# EAGLE schematic PKG900000001506 (EAGLE 7.7.0)

## Sheet 1 of 18
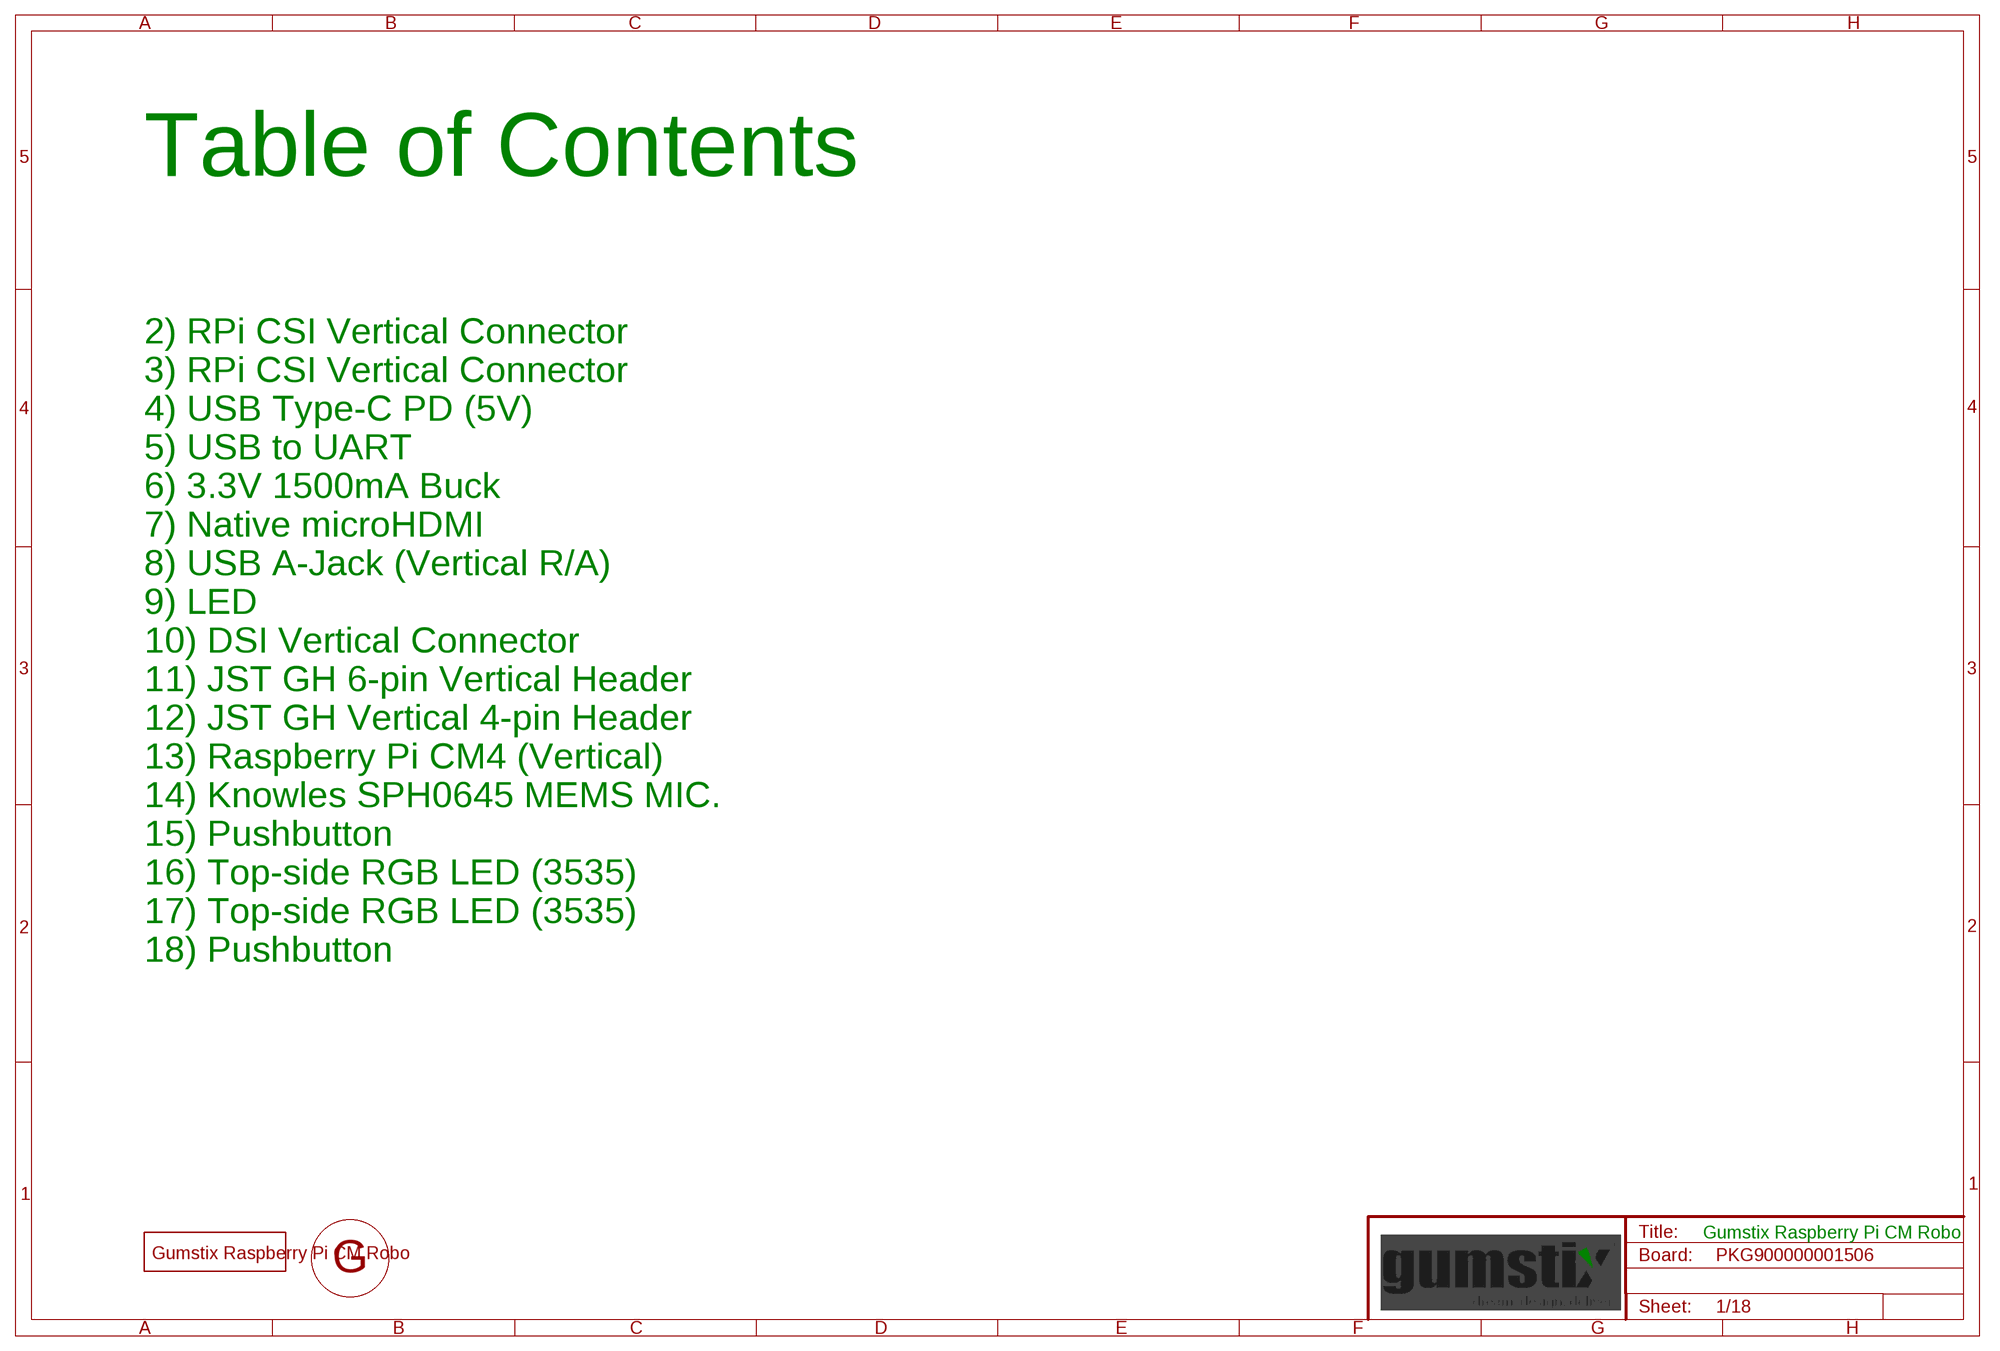
[diagram p0: schematic, sheet 1]

### Parts
FD1  DNP  FIDUCIAL  [FIDUCIAL]
FD2  DNP  FIDUCIAL  [FIDUCIAL]
FD3  DNP  FIDUCIAL  [FIDUCIAL]
FD4  DNP  FIDUCIAL  [FIDUCIAL]
FD5  DNP  FIDUCIAL  [FIDUCIAL]
FD6  DNP  FIDUCIAL  [FIDUCIAL]
FD7  DNP  FIDUCIAL  [FIDUCIAL]
FD8  DNP  FIDUCIAL  [FIDUCIAL]
U$4  DNP  GEPPETTO_LABEL"  [GEPPETTO_LABEL]
U$5  DNP  GEPPETTO_LOGO10X10  [GEPPETTO_LOGO_SILK10]

### Notes on the sheet
- Table of Contents
- 2) RPi CSI Vertical Connector
- 3) RPi CSI Vertical Connector
- 4) USB Type-C PD (5V)
- 5) USB to UART
- 6) 3.3V 1500mA Buck
- 7) Native microHDMI
- 8) USB A-Jack (Vertical R/A)
- 9) LED
- 10) DSI Vertical Connector
- 11) JST GH 6-pin Vertical Header
- 12) JST GH Vertical 4-pin Header
- 13) Raspberry Pi CM4 (Vertical)
- 14) Knowles SPH0645 MEMS MIC.
- 15) Pushbutton
- 16) Top-side RGB LED (3535)
- 17) Top-side RGB LED (3535)
- 18) Pushbutton
- Gumstix Raspberry Pi CM Robo

## Sheet 2 of 18
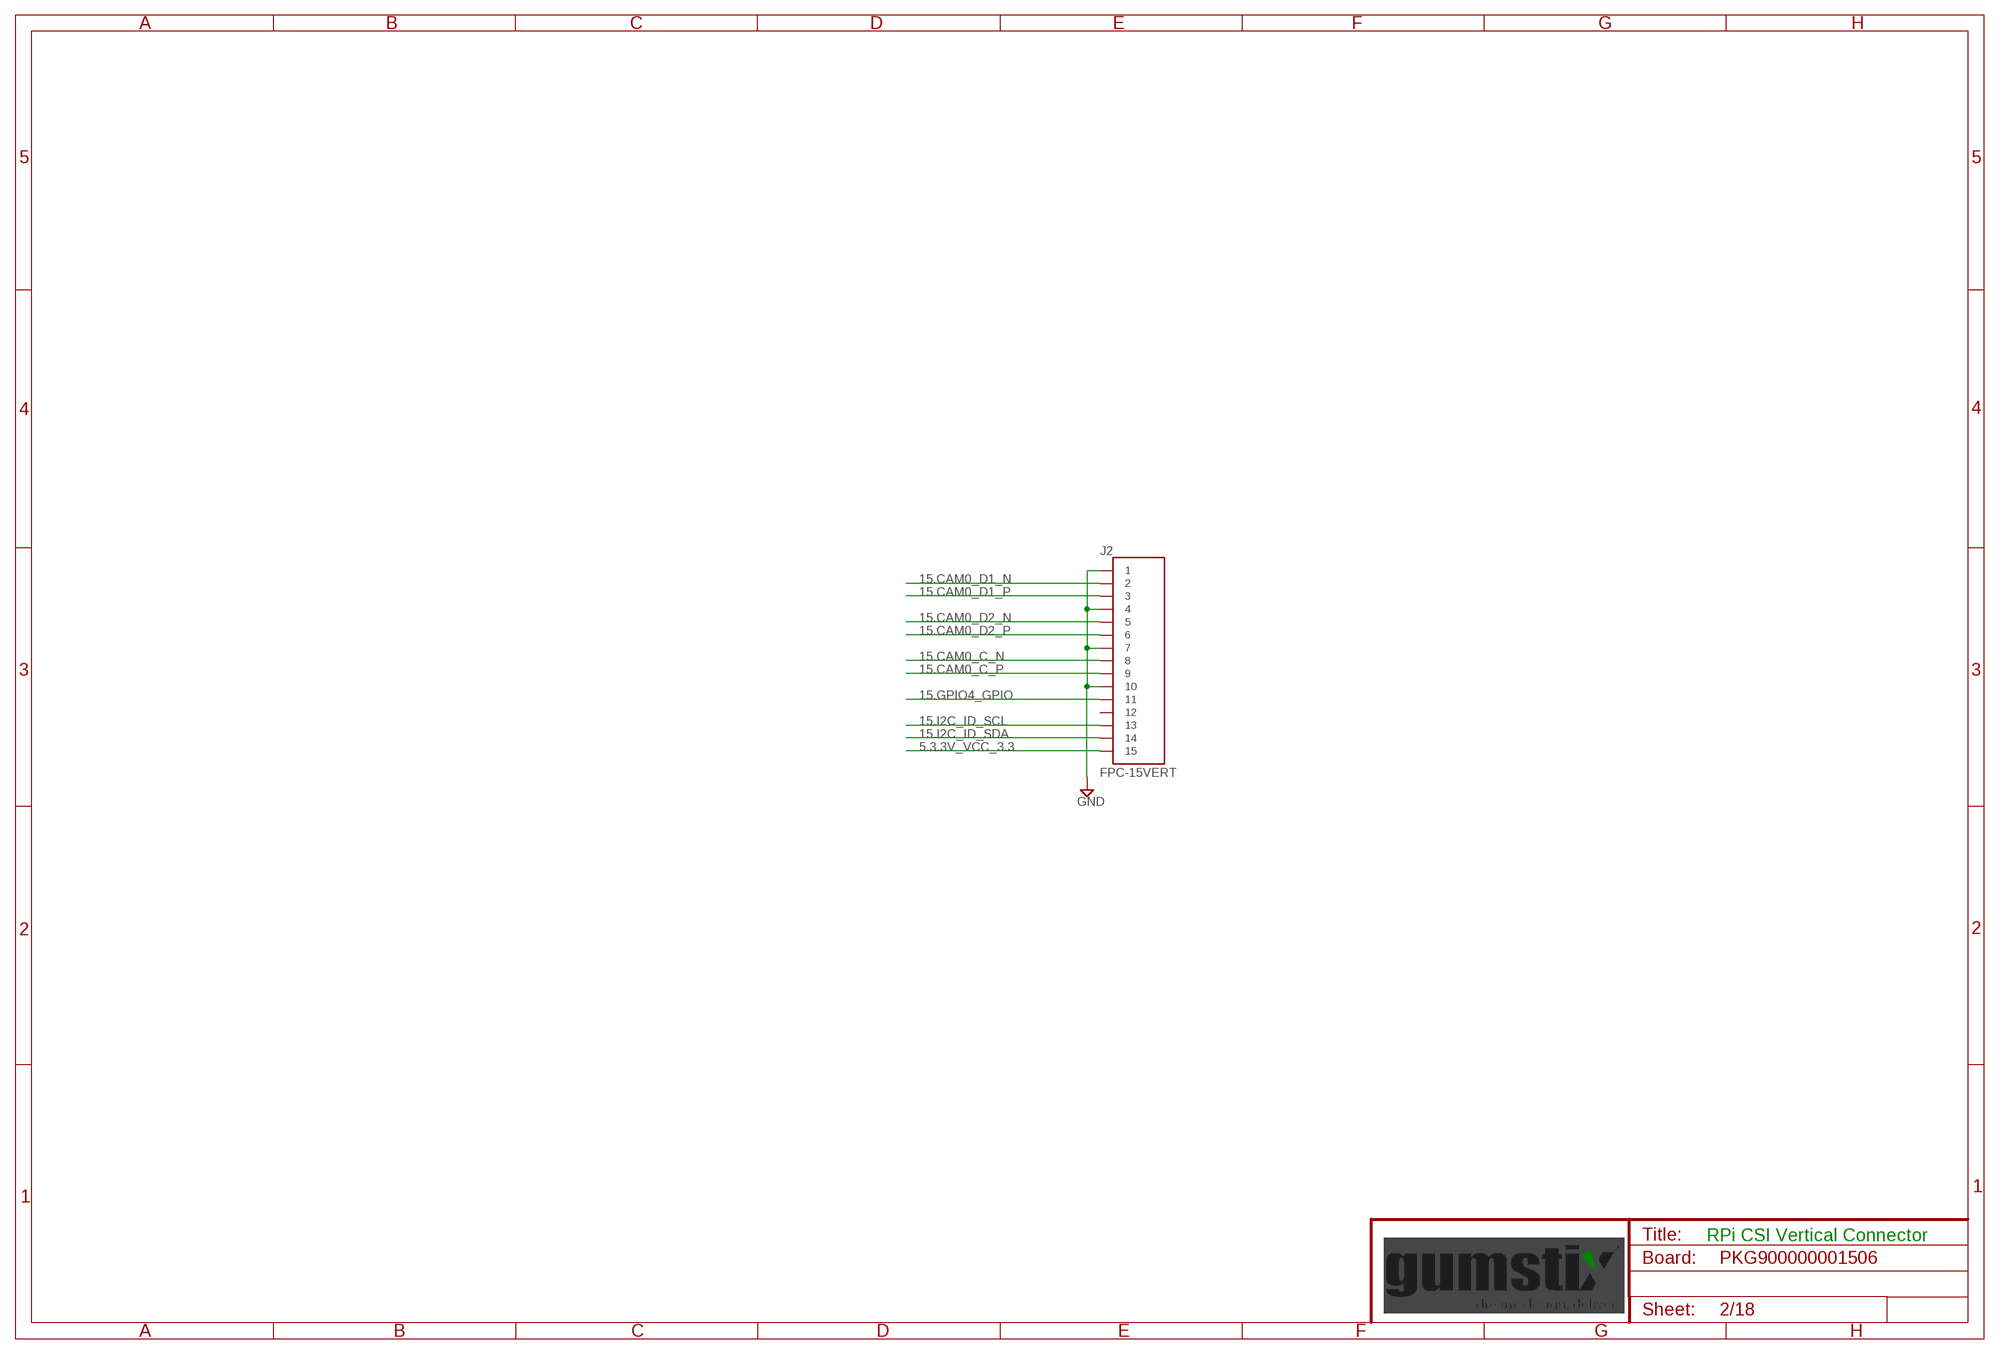
[diagram p1: schematic, sheet 2]

### Parts
J2  FPC-15VERT  [1-1734248-5]

### Nets
5.3.3V_VCC_3.3 [supply]: J2.1_15 ; also sheet 3,6,8,9,10,11,12,14
15.CAM0_C_N [HDMI]: J2.1_8 ; also sheet 13
15.CAM0_C_P [HDMI]: J2.1_9 ; also sheet 13
15.CAM0_D1_N [HDMI]: J2.1_2 ; also sheet 13
15.CAM0_D1_P [HDMI]: J2.1_3 ; also sheet 13
15.CAM0_D2_N [HDMI]: J2.1_5 ; also sheet 13
15.CAM0_D2_P [HDMI]: J2.1_6 ; also sheet 13
15.GPIO4_GPIO: J2.1_11 ; also sheet 13
15.I2C_ID_SCL: J2.1_13 ; also sheet 13
15.I2C_ID_SDA: J2.1_14 ; also sheet 13
GND [supply]: J2.1_1 J2.1_4 J2.1_7 J2.1_10 ; also sheet 3,4,5,6,7,8,9,10,11,12,13,14,15,16,17,18
Unconnected: J2.1_12

### Notes on the sheet
- RPi CSI Vertical Connector

## Sheet 3 of 18
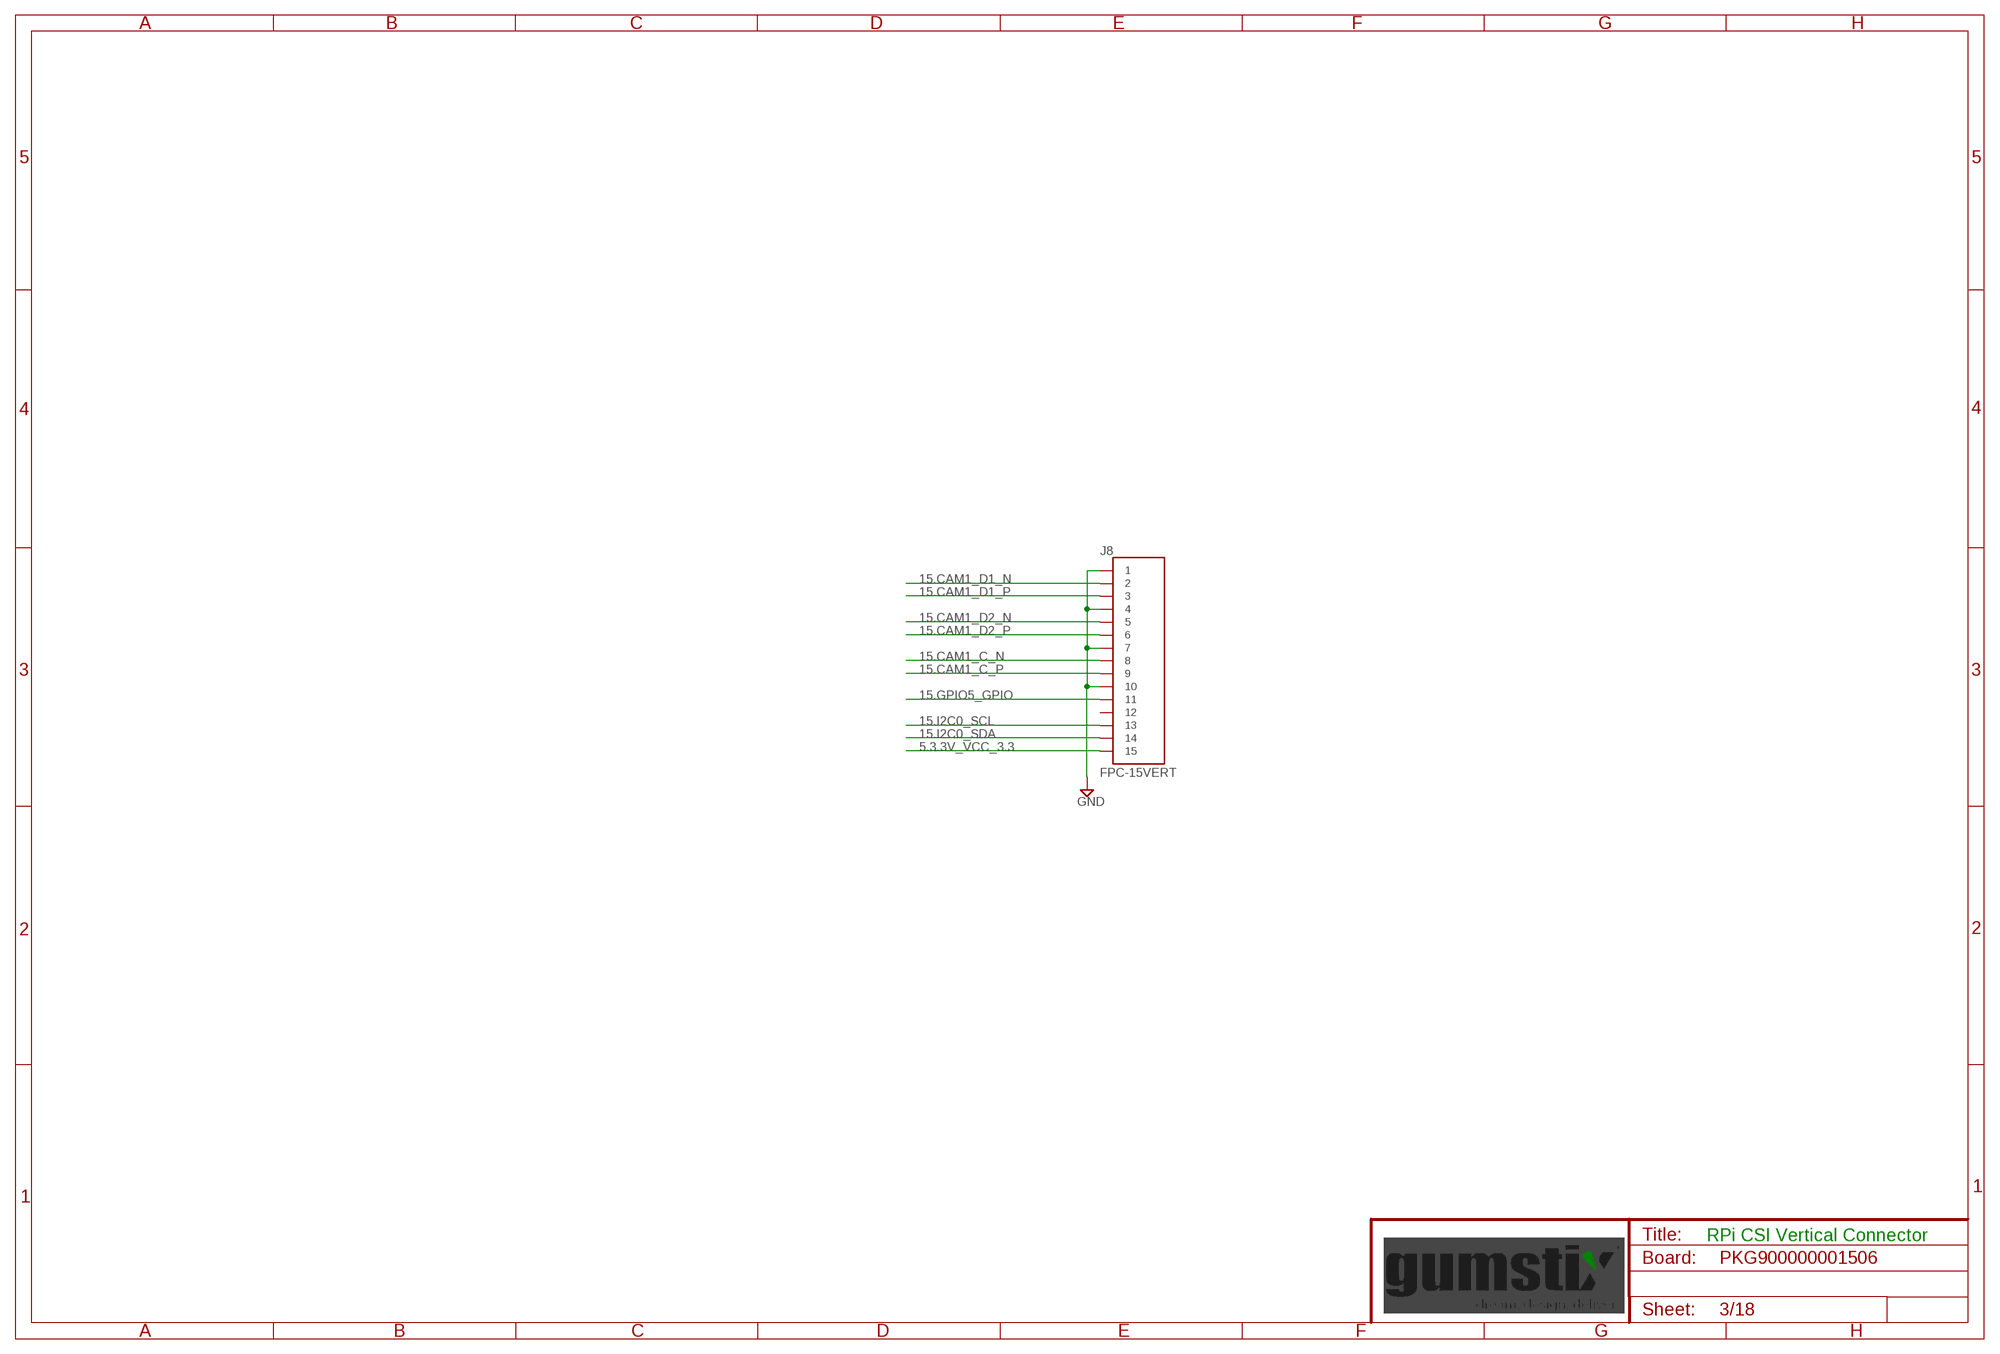
[diagram p2: schematic, sheet 3]

### Parts
J8  FPC-15VERT  [1-1734248-5]

### Nets
5.3.3V_VCC_3.3 [supply]: J8.1_15 ; also sheet 2,6,8,9,10,11,12,14
15.CAM1_C_N [HDMI]: J8.1_8 ; also sheet 13
15.CAM1_C_P [HDMI]: J8.1_9 ; also sheet 13
15.CAM1_D1_N [HDMI]: J8.1_2 ; also sheet 13
15.CAM1_D1_P [HDMI]: J8.1_3 ; also sheet 13
15.CAM1_D2_N [HDMI]: J8.1_5 ; also sheet 13
15.CAM1_D2_P [HDMI]: J8.1_6 ; also sheet 13
15.GPIO5_GPIO: J8.1_11 ; also sheet 13
15.I2C0_SCL: J8.1_13 ; also sheet 10,13
15.I2C0_SDA: J8.1_14 ; also sheet 10,13
GND [supply]: J8.1_1 J8.1_4 J8.1_7 J8.1_10 ; also sheet 2,4,5,6,7,8,9,10,11,12,13,14,15,16,17,18
Unconnected: J8.1_12

### Notes on the sheet
- RPi CSI Vertical Connector

## Sheet 4 of 18
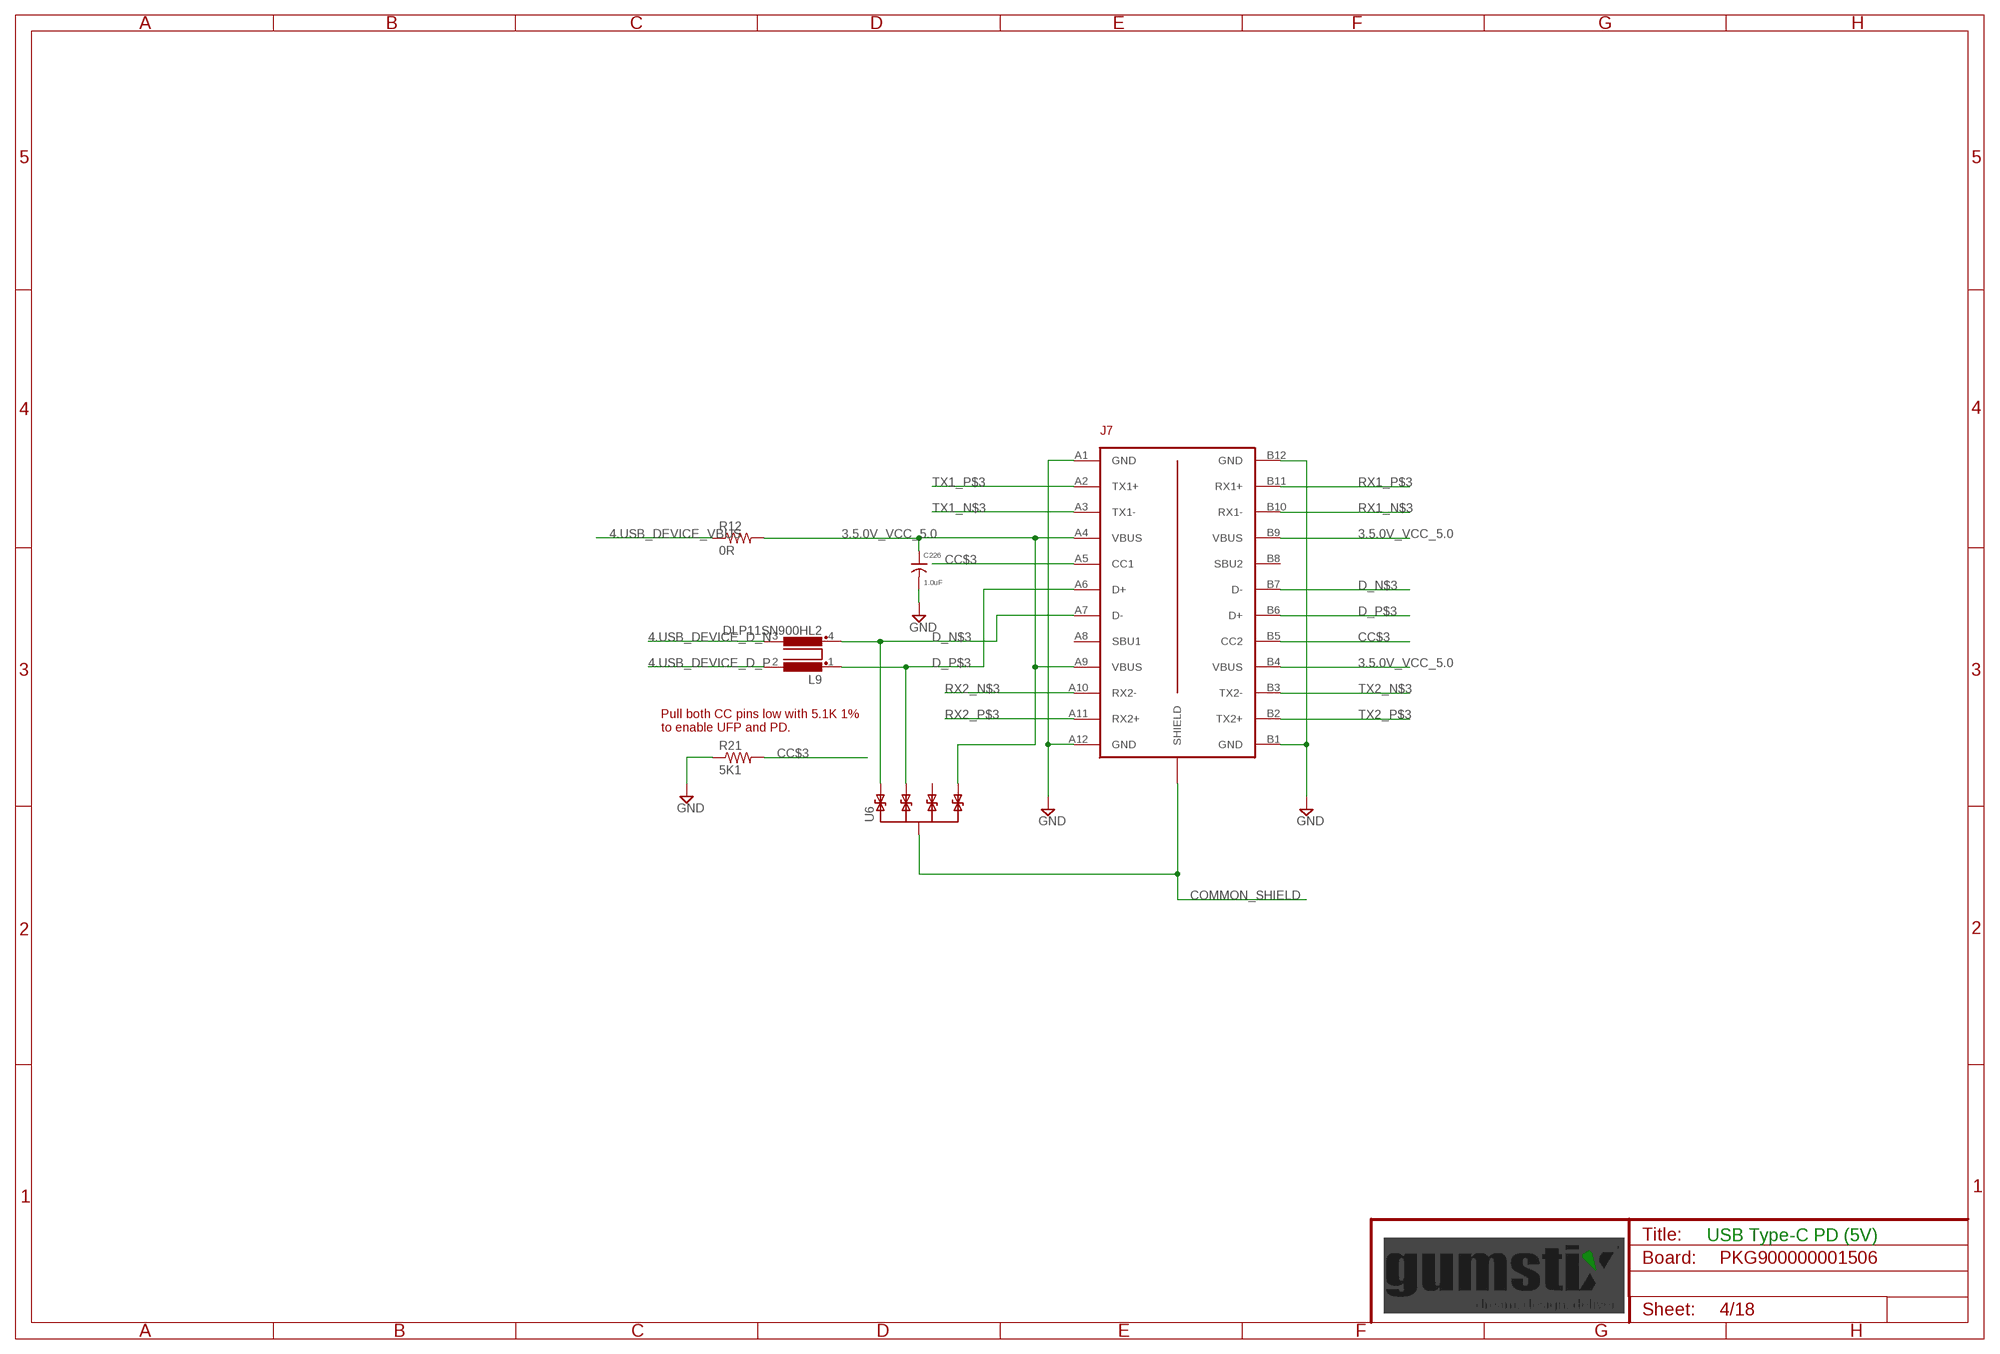
[diagram p3: schematic, sheet 4]

### Parts
C226  1.0uF  C0402  [0402]
J7  USB-TYPE-C  [USB-TYPE-C-SMT]
L9  DLP11SN900HL2  COM_MODE_CHOKE  [0504-DLP11S]
R12  0R  R0201  [0201]
R21  5K1  R0201  [0201]
U6  TPD4E02B0410-USON  [UFDFN-10]

### Nets
3.5.0V_VCC_5.0 [supply]: C226.1 J7.A4(VBUS) J7.A9(VBUS) J7.B4(VBUS) J7.B9(VBUS) R12.2 U6.5(P4) U6.6(P4) ; also sheet 6,7,8,11,12,13,16,17
4.USB_DEVICE_D_N [USB]: L9.3 ; also sheet 5
4.USB_DEVICE_D_P [USB]: L9.2 ; also sheet 5
4.USB_DEVICE_VBUS [supply]: R12.1 ; also sheet 5
CC$3: J7.A5(CC1) J7.B5(CC2) R21.2
COMMON_SHIELD [supply]: J7.P$1(SHIELD) J7.P$2(SHIELD) J7.P$3(SHIELD) J7.P$4(SHIELD) U6.3(SHIELD) U6.8(SHIELD) ; also sheet 7,8
D_N$3 [USB]: J7.A7(D-) J7.B7(D-) L9.4 U6.1 U6.10(P1)
D_P$3 [USB]: J7.A6(D+) J7.B6(D+) L9.1 U6.2 U6.9(P2)
GND [supply]: C226.2 J7.A1(GND) J7.A12(GND) J7.B1(GND) J7.B12(GND) R21.1 ; also sheet 2,3,5,6,7,8,9,10,11,12,13,14,15,16,17,18
RX1_N$3 [USB]: J7.B10(RX1-)
RX1_P$3 [USB]: J7.B11(RX1+)
RX2_N$3 [USB]: J7.A10(RX2-)
RX2_P$3 [USB]: J7.A11(RX2+)
TX1_N$3 [USB]: J7.A3(TX1-)
TX1_P$3 [USB]: J7.A2(TX1+)
TX2_N$3 [USB]: J7.B3(TX2-)
TX2_P$3 [USB]: J7.B2(TX2+)
Unconnected: J7.A8(SBU1) J7.B8(SBU2) U6.4(P3) U6.7(P3)

### Notes on the sheet
- Pull both CC pins low with 5.1K 1%
  to enable UFP and PD.
- USB Type-C PD (5V)

## Sheet 5 of 18
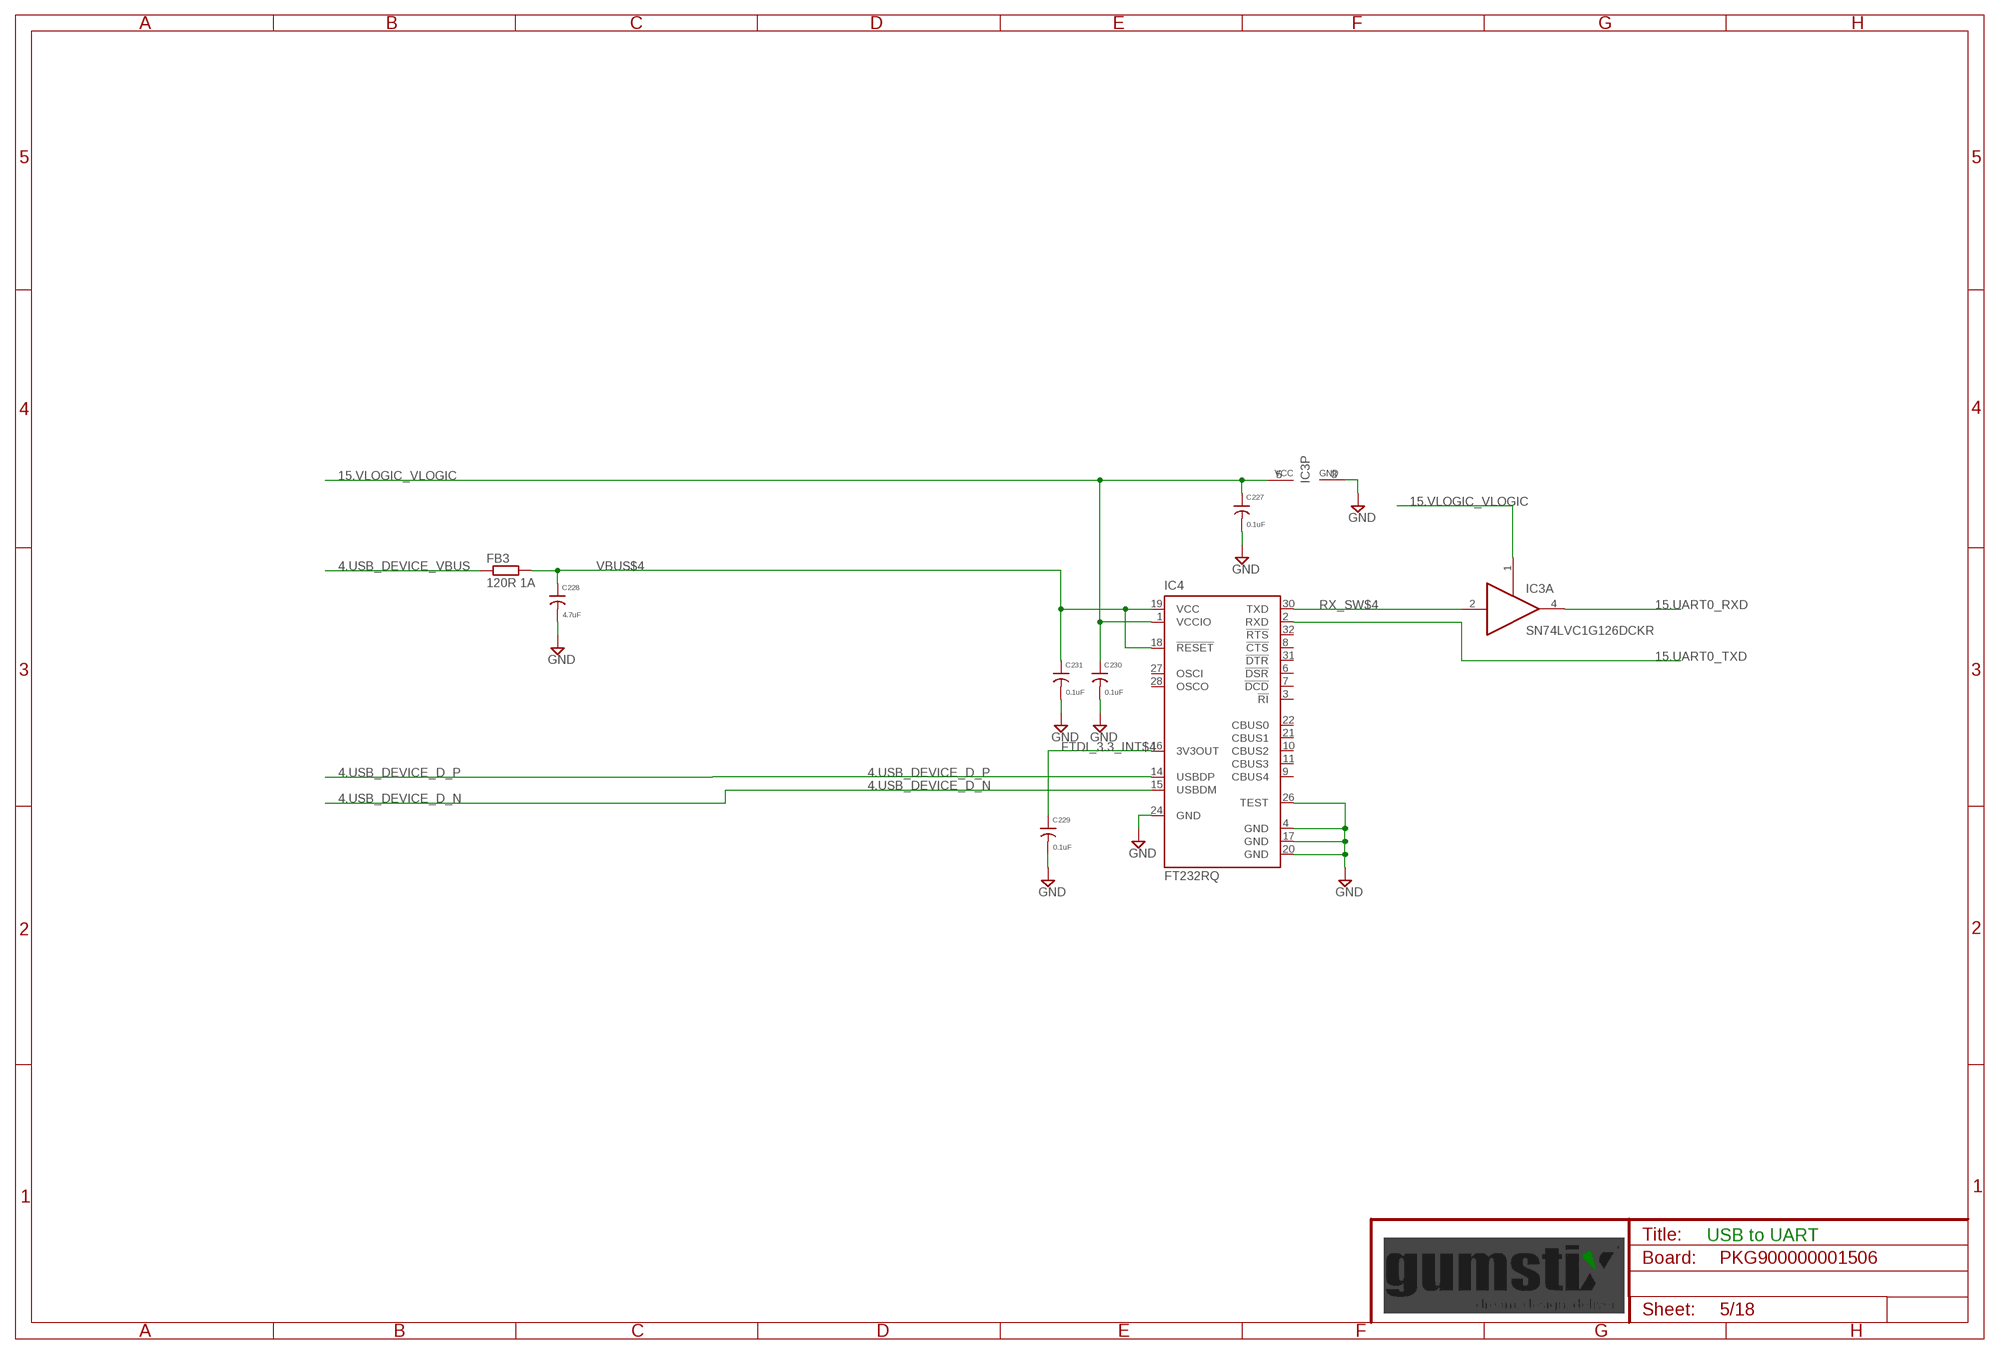
[diagram p4: schematic, sheet 5]

### Parts
C227  0.1uF  C0201  [0201]
C228  4.7uF  C0603  [0603]
C229  0.1uF  C0201  [0201]
C230  0.1uF  C0201  [0201]
C231  0.1uF  C0201  [0201]
FB3  120R 1A  FB0402  [0402]
IC3  SN74LVC1G126DCKR  [SC70-5]
IC4  FT232RQ  [QFN32]

### Nets
4.USB_DEVICE_D_N [USB]: IC4.15(USBDM) ; also sheet 4
4.USB_DEVICE_D_P [USB]: IC4.14(USBDP) ; also sheet 4
4.USB_DEVICE_VBUS [supply]: FB3.1 ; also sheet 4
15.UART0_RXD: IC3.4(A:O) ; also sheet 13
15.UART0_TXD: IC4.2(RXD) ; also sheet 13
15.VLOGIC_VLOGIC [supply]: C227.1 C230.1 IC3.1(A:OE) IC3.5(P:VCC) IC4.1(VCCIO) ; also sheet 7,11,12,13,15,17,18
FTDI_3.3_INT$4 [supply]: C229.1 IC4.16(3V3OUT)
GND [supply]: C227.2 C228.2 C229.2 C230.2 C231.2 IC3.3(P:GND) IC4.4(GND) IC4.17(GND) IC4.20(GND) IC4.24(GND) IC4.26(TEST) ; also sheet 2,3,4,6,7,8,9,10,11,12,13,14,15,16,17,18
RX_SW$4: IC3.2(A:I) IC4.30(TXD)
VBUS$4 [supply]: C228.1 C231.1 FB3.2 IC4.18(!RESET) IC4.19(VCC)
Unconnected: IC4.3(!RI) IC4.6(!DSR) IC4.7(!DCD) IC4.8(!CTS) IC4.9(CBUS4) IC4.10(CBUS2) IC4.11(CBUS3) IC4.21(CBUS1) IC4.22(CBUS0) IC4.27(OSCI) IC4.28(OSCO) IC4.31(!DTR) IC4.32(!RTS)

### Notes on the sheet
- USB to UART

## Sheet 6 of 18
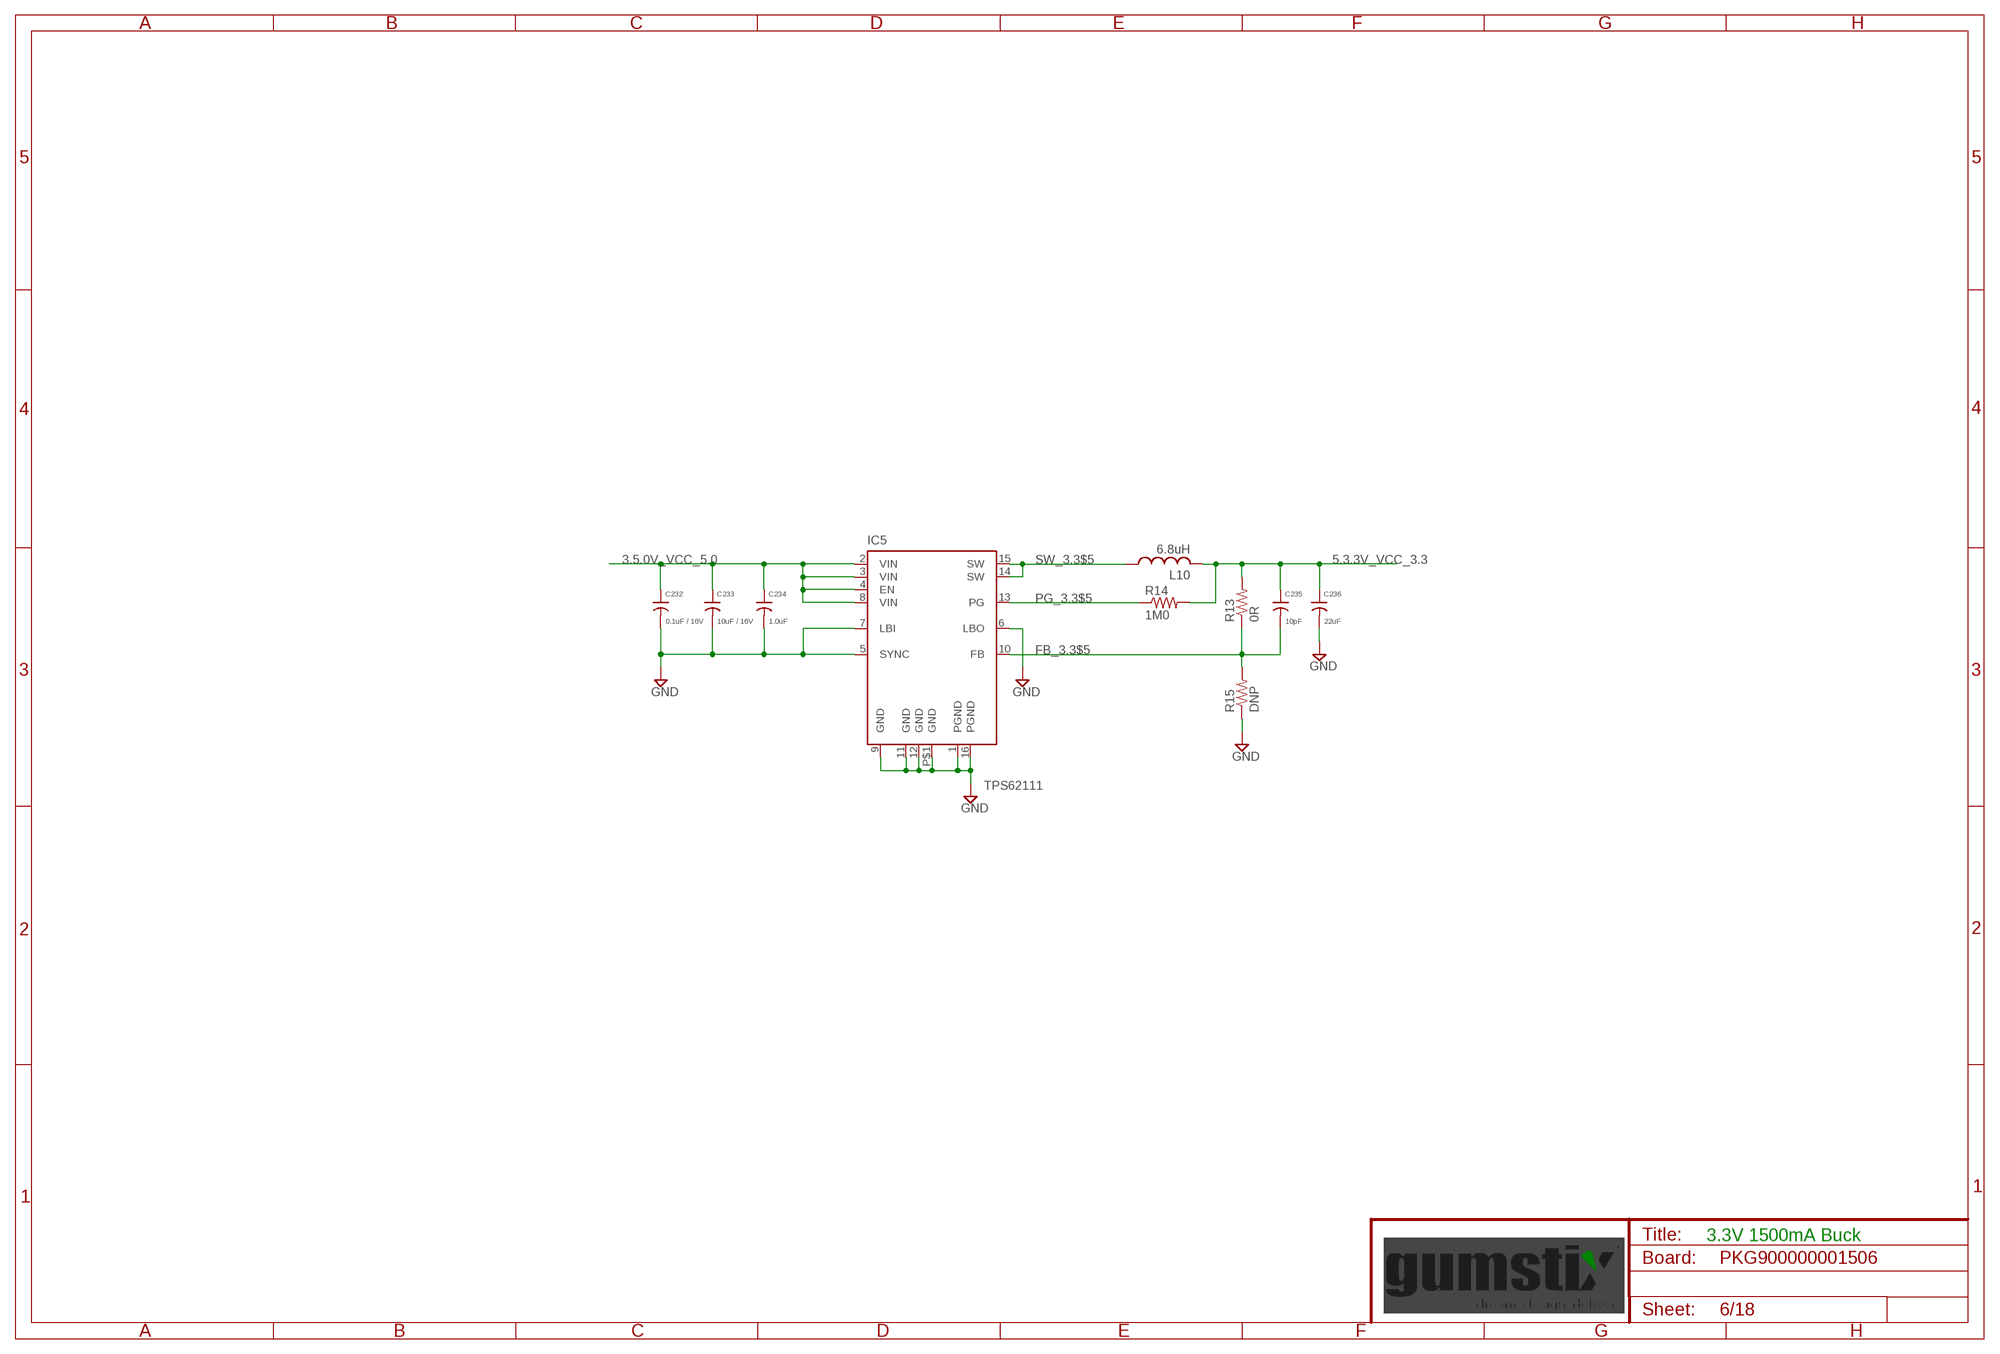
[diagram p5: schematic, sheet 6]

### Parts
C232  0.1uF / 16V  C0402  [0402]
C233  10uF / 16V  C0805  [0805]
C234  1.0uF  C0402  [0402]
C235  10pF  C0201  [0201]
C236  22uF  C0805  [0805]
IC5  TPS62111  [PQFP16]
L10  6.8uH  L1515  [1515]
R13  0R  R0402  [0402]
R14  1M0  R0201  [0201]
R15  DNP  R0402  [0402]

### Nets
3.5.0V_VCC_5.0 [supply]: C232.1 C233.1 C234.1 IC5.2(VIN) IC5.3(VIN) IC5.4(EN) IC5.8(VIN) ; also sheet 4,7,8,11,12,13,16,17
5.3.3V_VCC_3.3 [supply]: C235.1 C236.1 L10.2 R13.2 R14.2 ; also sheet 2,3,8,9,10,11,12,14
FB_3.3$5 [supply]: C235.2 IC5.10(FB) R13.1 R15.2
GND [supply]: C232.2 C233.2 C234.2 C236.2 IC5.1(PGND) IC5.5(SYNC) IC5.6(LBO) IC5.7(LBI) IC5.9(GND) IC5.11(GND) IC5.12(GND) IC5.16(PGND) IC5.P$1(GND) R15.1 ; also sheet 2,3,4,5,7,8,9,10,11,12,13,14,15,16,17,18
PG_3.3$5: IC5.13(PG) R14.1
SW_3.3$5 [supply]: IC5.14(SW) IC5.15(SW) L10.1

### Notes on the sheet
- 3.3V 1500mA Buck

## Sheet 7 of 18
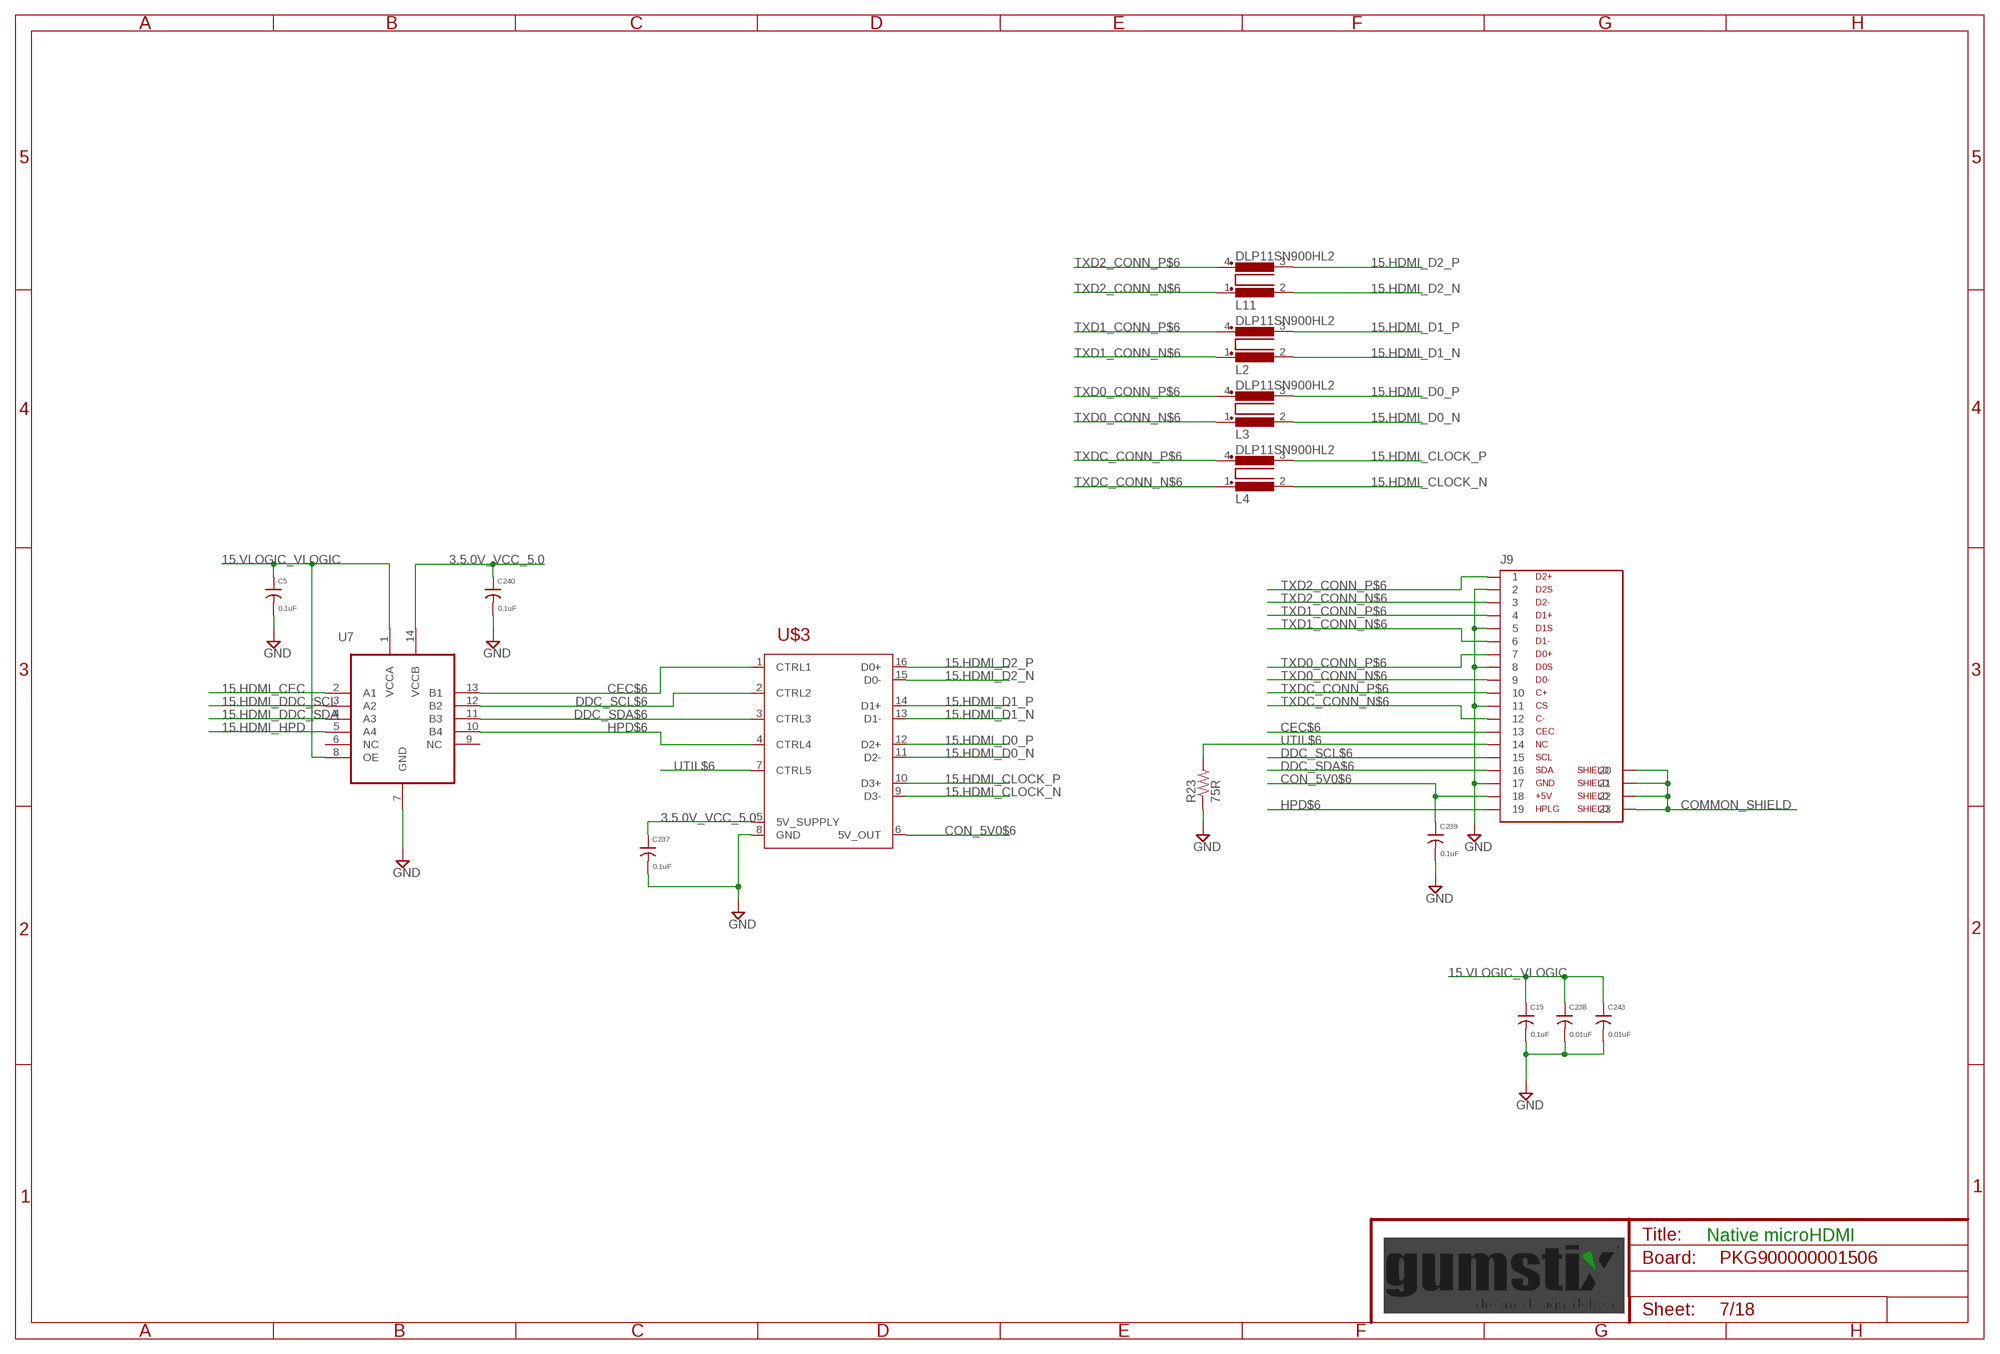
[diagram p6: schematic, sheet 7]

### Parts
C5  0.1uF  C0201  [0201]
C15  0.1uF  C0201  [0201]
C237  0.1uF  C0201  [0201]
C238  0.01uF  C0201  [0201]
C239  0.1uF  C0201  [0201]
C240  0.1uF  C0201  [0201]
C243  0.01uF  C0201  [0201]
J9  HDMIMICRO  [46765-001]
L2  DLP11SN900HL2  COM_MODE_CHOKE  [0504-DLP11S]
L3  DLP11SN900HL2  COM_MODE_CHOKE  [0504-DLP11S]
L4  DLP11SN900HL2  COM_MODE_CHOKE  [0504-DLP11S]
L11  DLP11SN900HL2  COM_MODE_CHOKE  [0504-DLP11S]
R23  75R  R0402  [0402]
U7  TXS0104E  [S-PVQFN-N14]
U$3  TPD13S523TSSOP  [TSSOP16]

### Nets
3.5.0V_VCC_5.0 [supply]: C237.1 C240.1 U7.14(VCCB) U$3.5(5V_SUPPLY) ; also sheet 4,6,8,11,12,13,16,17
15.HDMI_CEC: U7.2(A1) ; also sheet 13
15.HDMI_CLOCK_N [HDMI]: L4.2 U$3.9(D3-) ; also sheet 13
15.HDMI_CLOCK_P [HDMI]: L4.3 U$3.10(D3+) ; also sheet 13
15.HDMI_D0_N [HDMI]: L3.2 U$3.11(D2-) ; also sheet 13
15.HDMI_D0_P [HDMI]: L3.3 U$3.12(D2+) ; also sheet 13
15.HDMI_D1_N [HDMI]: L2.2 U$3.13(D1-) ; also sheet 13
15.HDMI_D1_P [HDMI]: L2.3 U$3.14(D1+) ; also sheet 13
15.HDMI_D2_N [HDMI]: L11.2 U$3.15(D0-) ; also sheet 13
15.HDMI_D2_P [HDMI]: L11.3 U$3.16(D0+) ; also sheet 13
15.HDMI_DDC_SCL: U7.3(A2) ; also sheet 13
15.HDMI_DDC_SDA: U7.4(A3) ; also sheet 13
15.HDMI_HPD: U7.5(A4) ; also sheet 13
15.VLOGIC_VLOGIC [supply]: C5.1 C15.1 C238.1 C243.1 U7.1(VCCA) U7.8(OE) ; also sheet 5,11,12,13,15,17,18
CEC$6: J9.15 U7.13(B1) U$3.1(CTRL1)
COMMON_SHIELD [supply]: J9.CON1 J9.CON2 J9.CON3 J9.CON4 ; also sheet 4,8
CON_5V0$6 [supply]: C239.1 J9.19 U$3.6(5V_OUT)
DDC_SCL$6: J9.17 U7.12(B2) U$3.2(CTRL2)
DDC_SDA$6: J9.18 U7.11(B3) U$3.3(CTRL3)
GND [supply]: C5.2 C15.2 C237.2 C238.2 C239.2 C240.2 C243.2 J9.4 J9.7 J9.10 J9.13 J9.16 R23.1 U7.7(GND) U$3.8(GND) ; also sheet 2,3,4,5,6,8,9,10,11,12,13,14,15,16,17,18
HPD$6: J9.1 U7.10(B4) U$3.4(CTRL4)
TXD0_CONN_N$6 [HDMI]: J9.11 L3.1
TXD0_CONN_P$6 [HDMI]: J9.9 L3.4
TXD1_CONN_N$6 [HDMI]: J9.8 L2.1
TXD1_CONN_P$6 [HDMI]: J9.6 L2.4
TXD2_CONN_N$6 [HDMI]: J9.5 L11.1
TXD2_CONN_P$6 [HDMI]: J9.3 L11.4
TXDC_CONN_N$6 [HDMI]: J9.14 L4.1
TXDC_CONN_P$6 [HDMI]: J9.12 L4.4
UTIL$6: J9.2 R23.2 U$3.7(CTRL5)
Unconnected: U7.6(NC) U7.9(NC)

### Notes on the sheet
- Native microHDMI

## Sheet 8 of 18
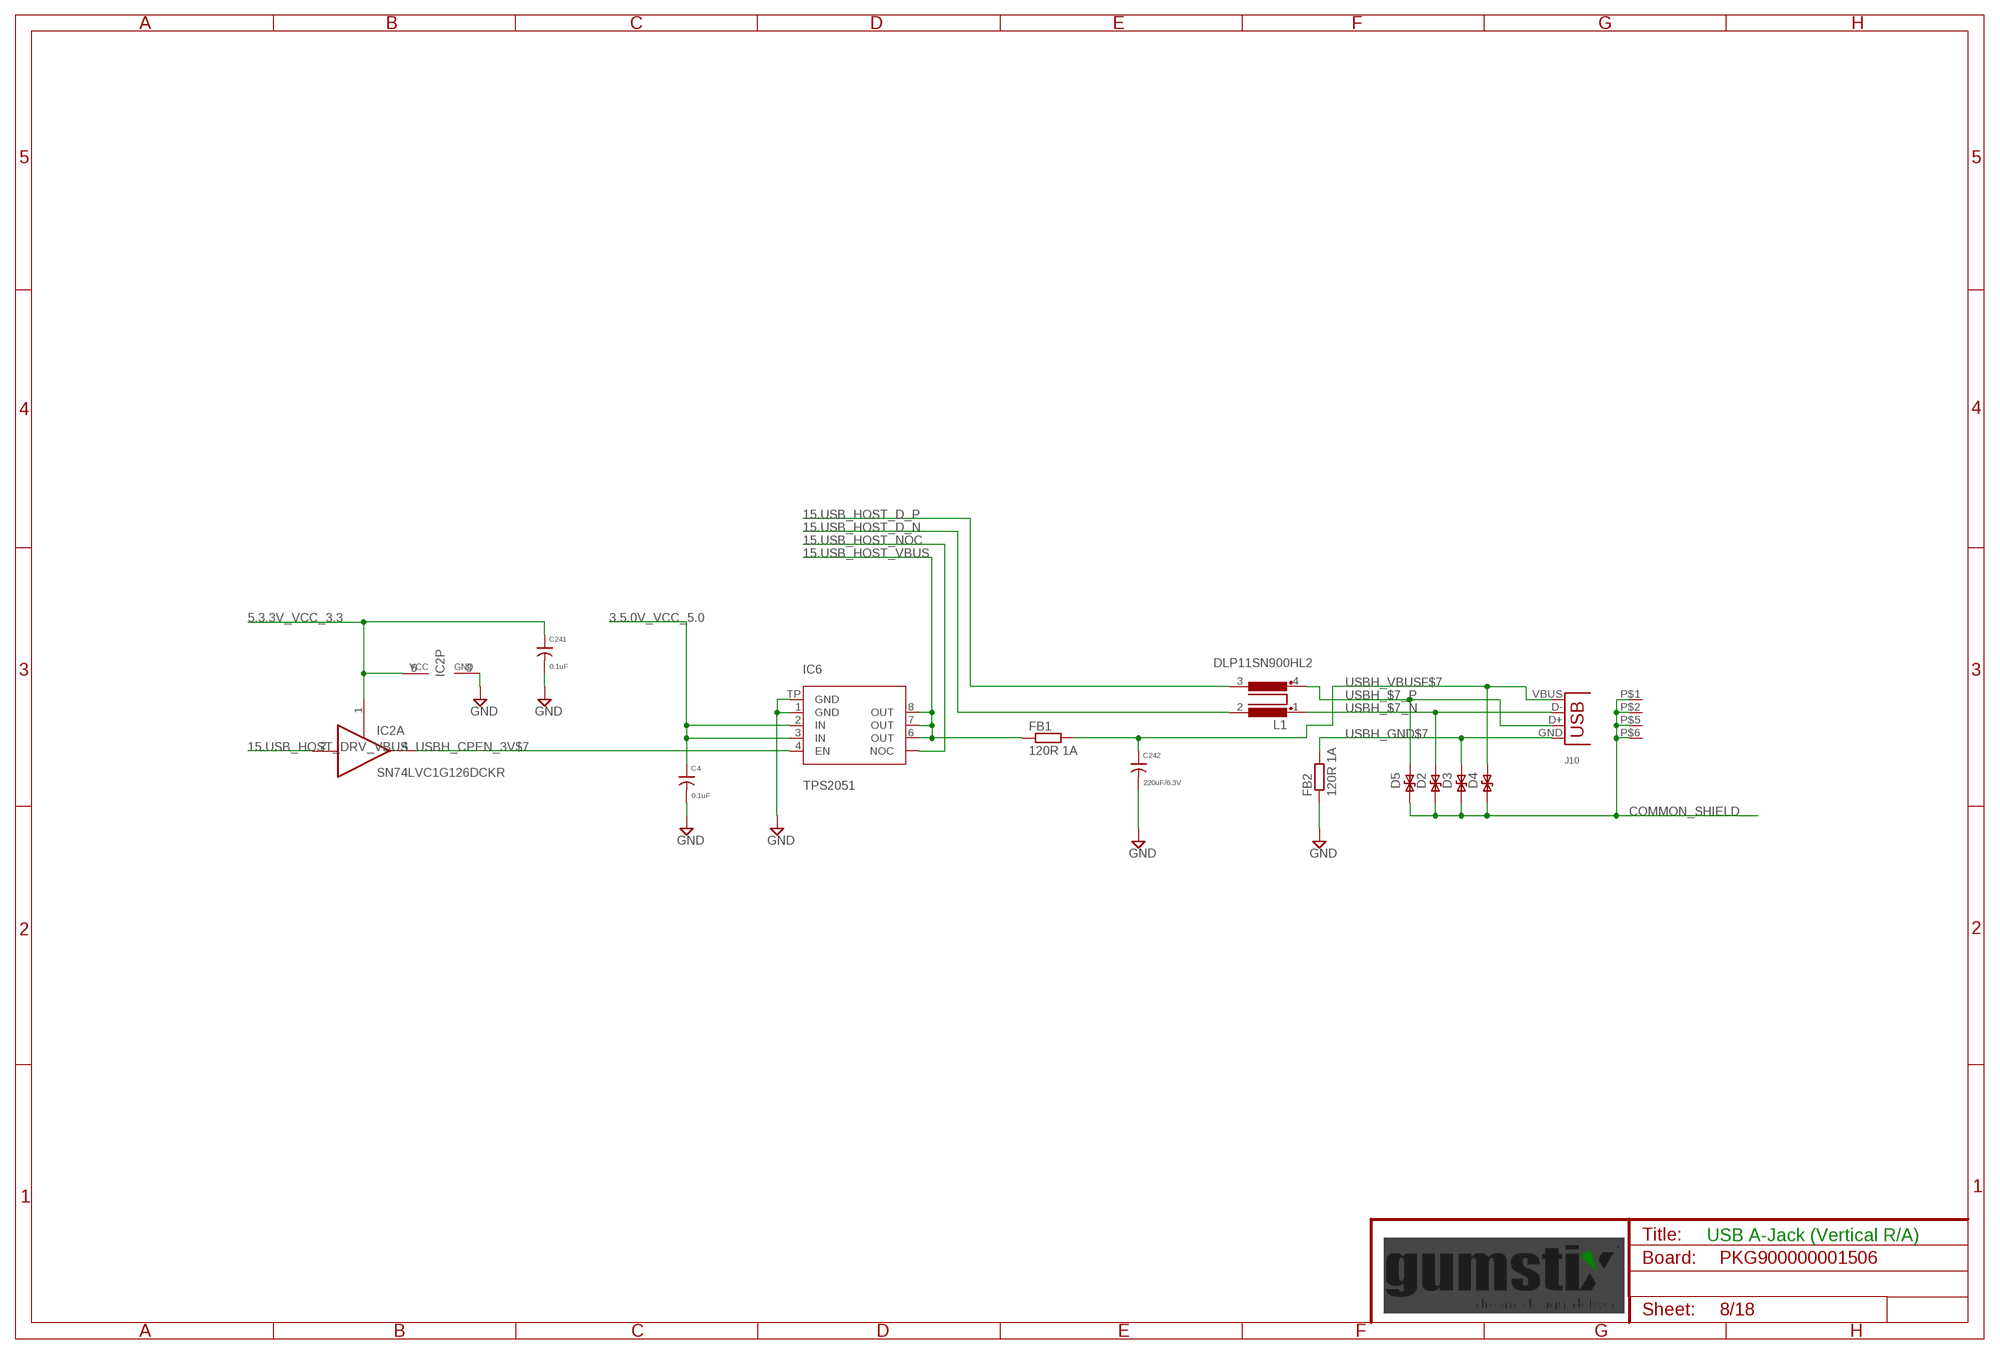
[diagram p7: schematic, sheet 8]

### Parts
C4  0.1uF  C0201  [0201]
C241  0.1uF  C0201  [0201]
C242  220uF/6.3V  C1206  [1206]
D2  PS04LTVA1  ESD-DIODE  [D0402]
D3  B72590D50A060  ESD-DIODE  [D0402]
D4  B72590D50A060  ESD-DIODE  [D0402]
D5  PS04LTVA1  ESD-DIODE  [D0402]
FB1  120R 1A  FB0402  [0402]
FB2  120R 1A  FB0402  [0402]
IC2  SN74LVC1G126DCKR  74AHC1G126DCK  [SC70-5]
IC6  TPS2051  [MSOP8-PAD]
J10  USB-A-H-RA  [USB-A-H-RA]
L1  DLP11SN900HL2  COM_MODE_CHOKE  [0504-DLP11S]

### Nets
3.5.0V_VCC_5.0 [supply]: C4.1 IC6.2(IN) IC6.3(IN) ; also sheet 4,6,7,11,12,13,16,17
5.3.3V_VCC_3.3 [supply]: C241.1 IC2.1(A:OE) IC2.5(P:VCC) ; also sheet 2,3,6,9,10,11,12,14
15.USB_HOST_D_N [USB]: L1.2 ; also sheet 13
15.USB_HOST_D_P [USB]: L1.3 ; also sheet 13
15.USB_HOST_DRV_VBUS: IC2.2(A:I) ; also sheet 13
15.USB_HOST_NOC: IC6.5(NOC) ; also sheet 13
15.USB_HOST_VBUS [supply]: FB1.1 IC6.6(OUT) IC6.7(OUT) IC6.8(OUT) ; also sheet 13
COMMON_SHIELD [supply]: D2.P1 D3.P1 D4.P1 D5.P1 J10.P$1(P1) J10.P$2(P2) J10.P$5(P3) J10.P$6(P4) ; also sheet 4,7
GND [supply]: C4.2 C241.2 C242.2 FB2.1 IC2.3(P:GND) IC6.1(GND) IC6.TP(GND) ; also sheet 2,3,4,5,6,7,9,10,11,12,13,14,15,16,17,18
USBH_$7_N [USB]: D2.P2 J10.D- L1.1
USBH_$7_P [USB]: D5.P2 J10.D+ L1.4
USBH_CPEN_3V$7: IC2.4(A:O) IC6.4(EN)
USBH_GND$7 [supply]: D3.P2 FB2.2 J10.GND
USBH_VBUSF$7 [supply]: C242.1 D4.P2 FB1.2 J10.VBUS

### Notes on the sheet
- USB A-Jack (Vertical R/A)

## Sheet 9 of 18
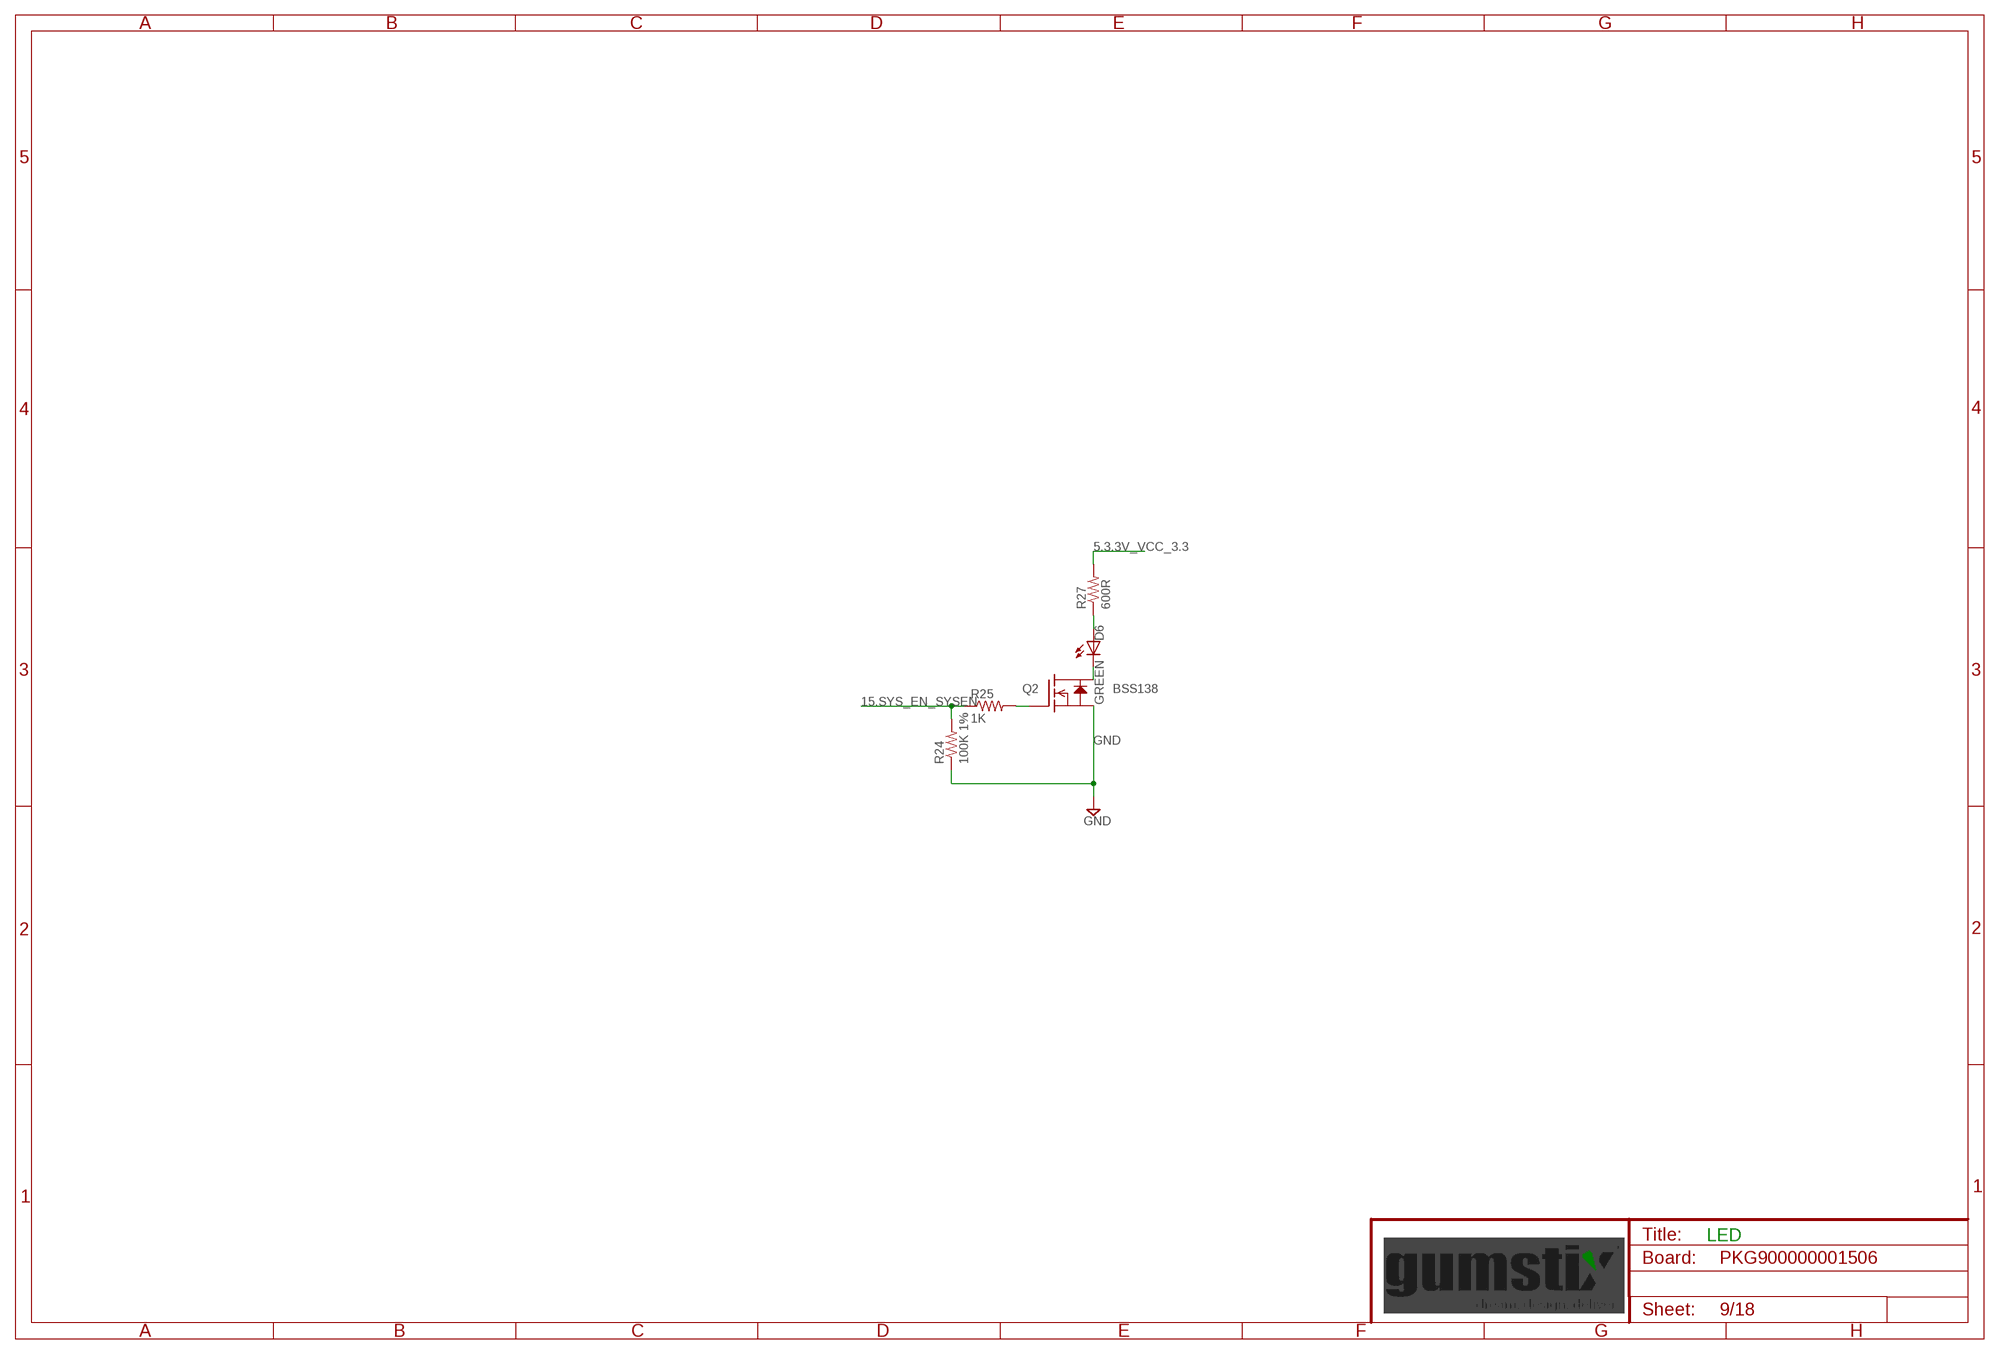
[diagram p8: schematic, sheet 9]

### Parts
D6  GREEN  LED0603  [D0603]
Q2  BSS138  [SOT23]
R24  100K 1%  R0201  [0201]
R25  1K  R0201  [0201]
R27  600R  R0402  [0402]

### Nets
5.3.3V_VCC_3.3 [supply]: R27.2 ; also sheet 2,3,6,8,10,11,12,14
15.SYS_EN_SYSEN: R24.2 R25.1 ; also sheet 13
ANODE$11: D6.A R27.1
GATE$11: Q2.1(G) R25.2
GND [supply]: Q2.2(S) R24.1 ; also sheet 2,3,4,5,6,7,8,10,11,12,13,14,15,16,17,18
LED-$11: D6.C Q2.3(D)

### Notes on the sheet
- LED

## Sheet 10 of 18
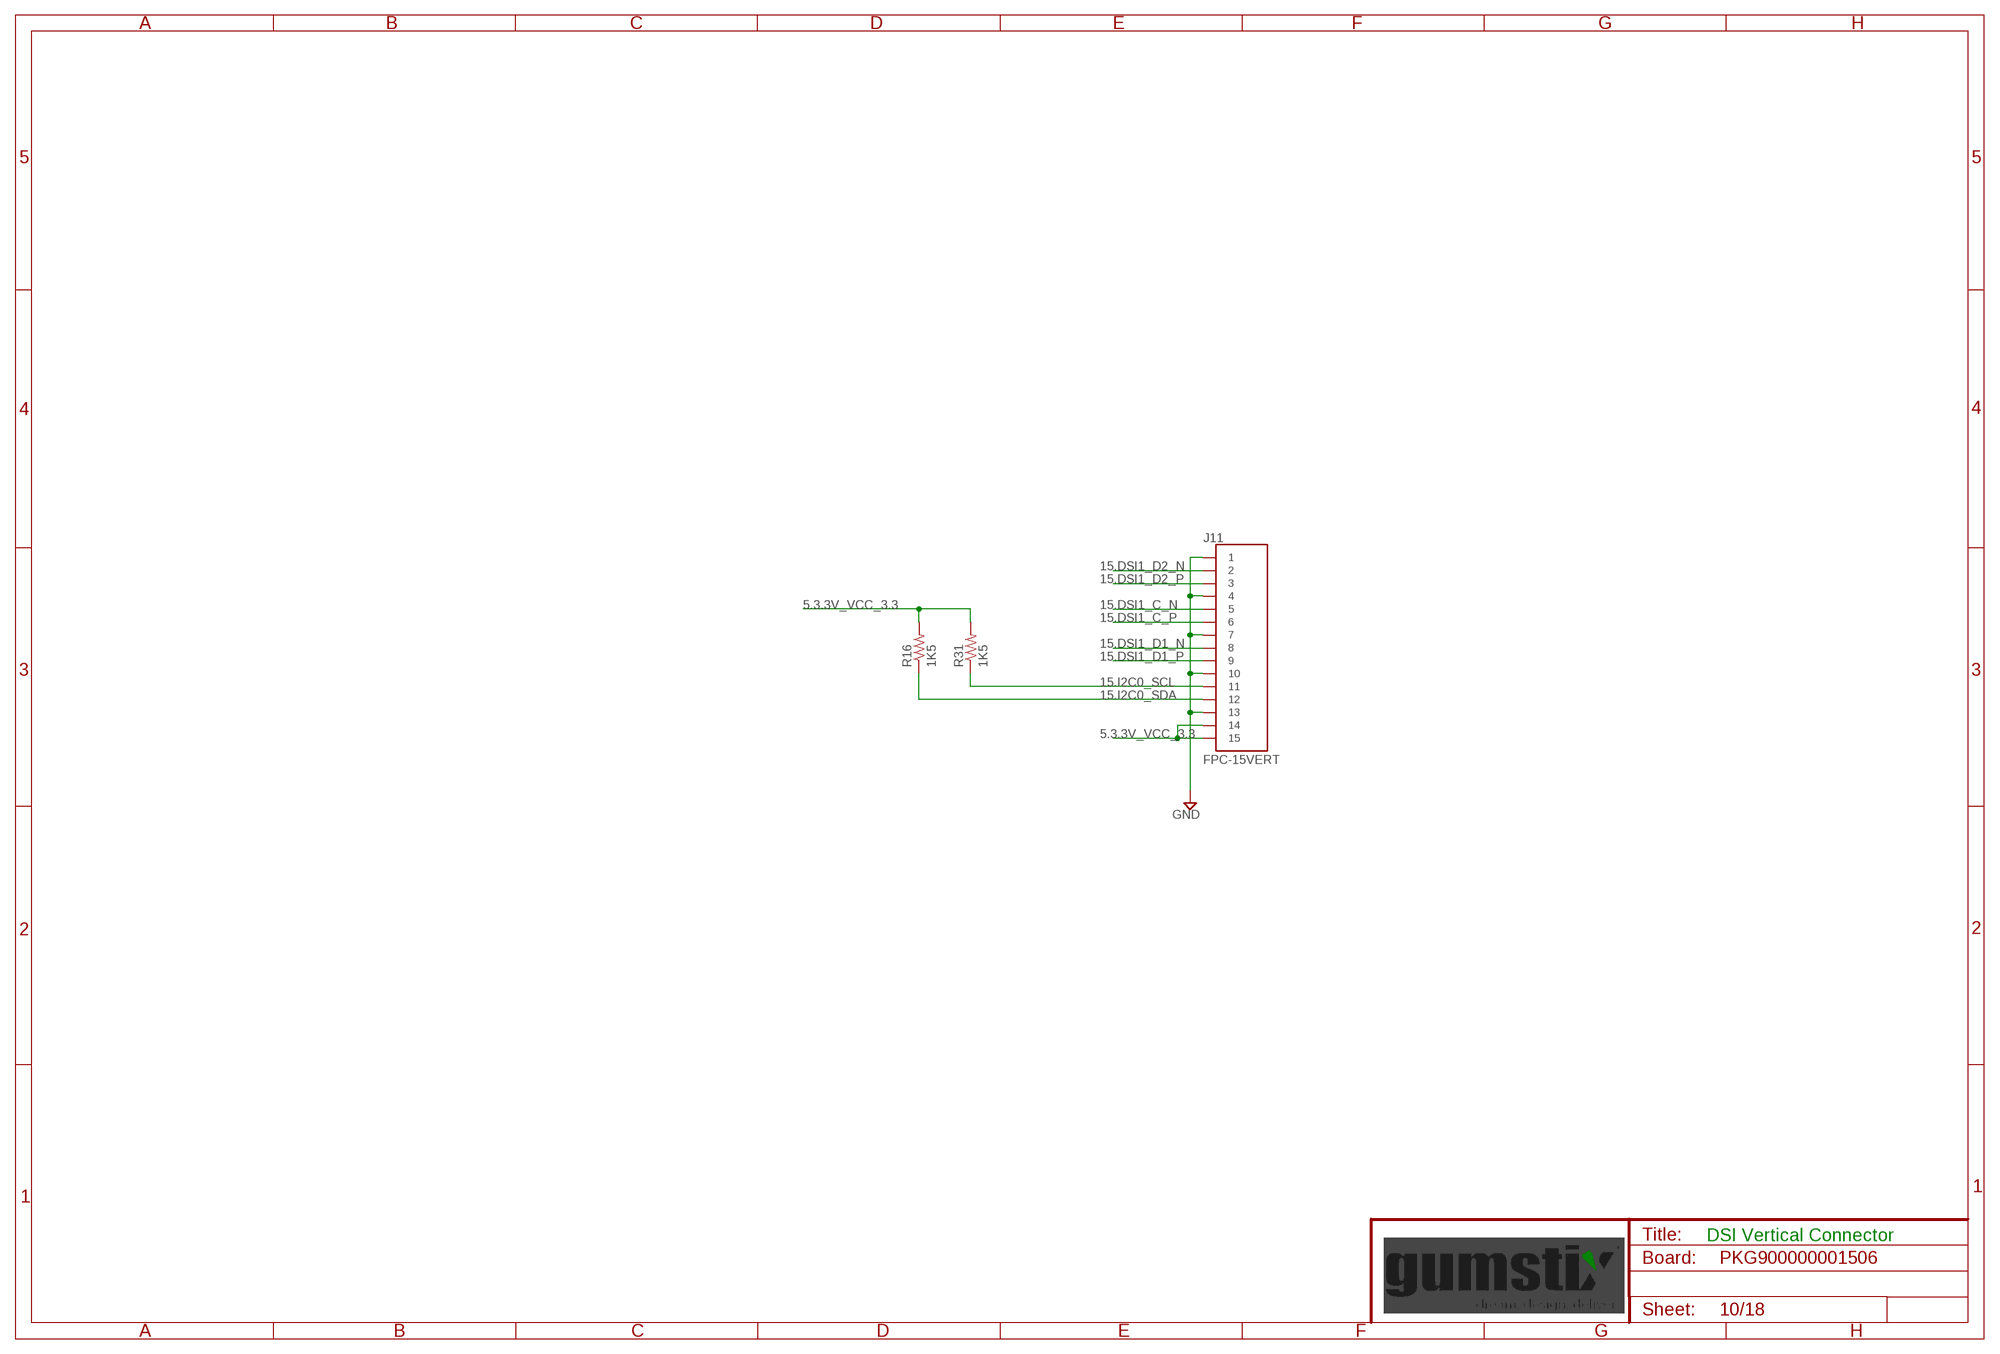
[diagram p9: schematic, sheet 10]

### Parts
J11  FPC-15VERT  [1-1734248-5]
R16  1K5  R0201  [0201]
R31  1K5  R0201  [0201]

### Nets
5.3.3V_VCC_3.3 [supply]: J11.1_14 J11.1_15 R16.2 R31.2 ; also sheet 2,3,6,8,9,11,12,14
15.DSI1_C_N [HDMI]: J11.1_5 ; also sheet 13
15.DSI1_C_P [HDMI]: J11.1_6 ; also sheet 13
15.DSI1_D1_N [HDMI]: J11.1_8 ; also sheet 13
15.DSI1_D1_P [HDMI]: J11.1_9 ; also sheet 13
15.DSI1_D2_N [HDMI]: J11.1_2 ; also sheet 13
15.DSI1_D2_P [HDMI]: J11.1_3 ; also sheet 13
15.I2C0_SCL: J11.1_11 R31.1 ; also sheet 3,13
15.I2C0_SDA: J11.1_12 R16.1 ; also sheet 3,13
GND [supply]: J11.1_1 J11.1_4 J11.1_7 J11.1_10 J11.1_13 ; also sheet 2,3,4,5,6,7,8,9,11,12,13,14,15,16,17,18

### Notes on the sheet
- DSI Vertical Connector

## Sheet 11 of 18
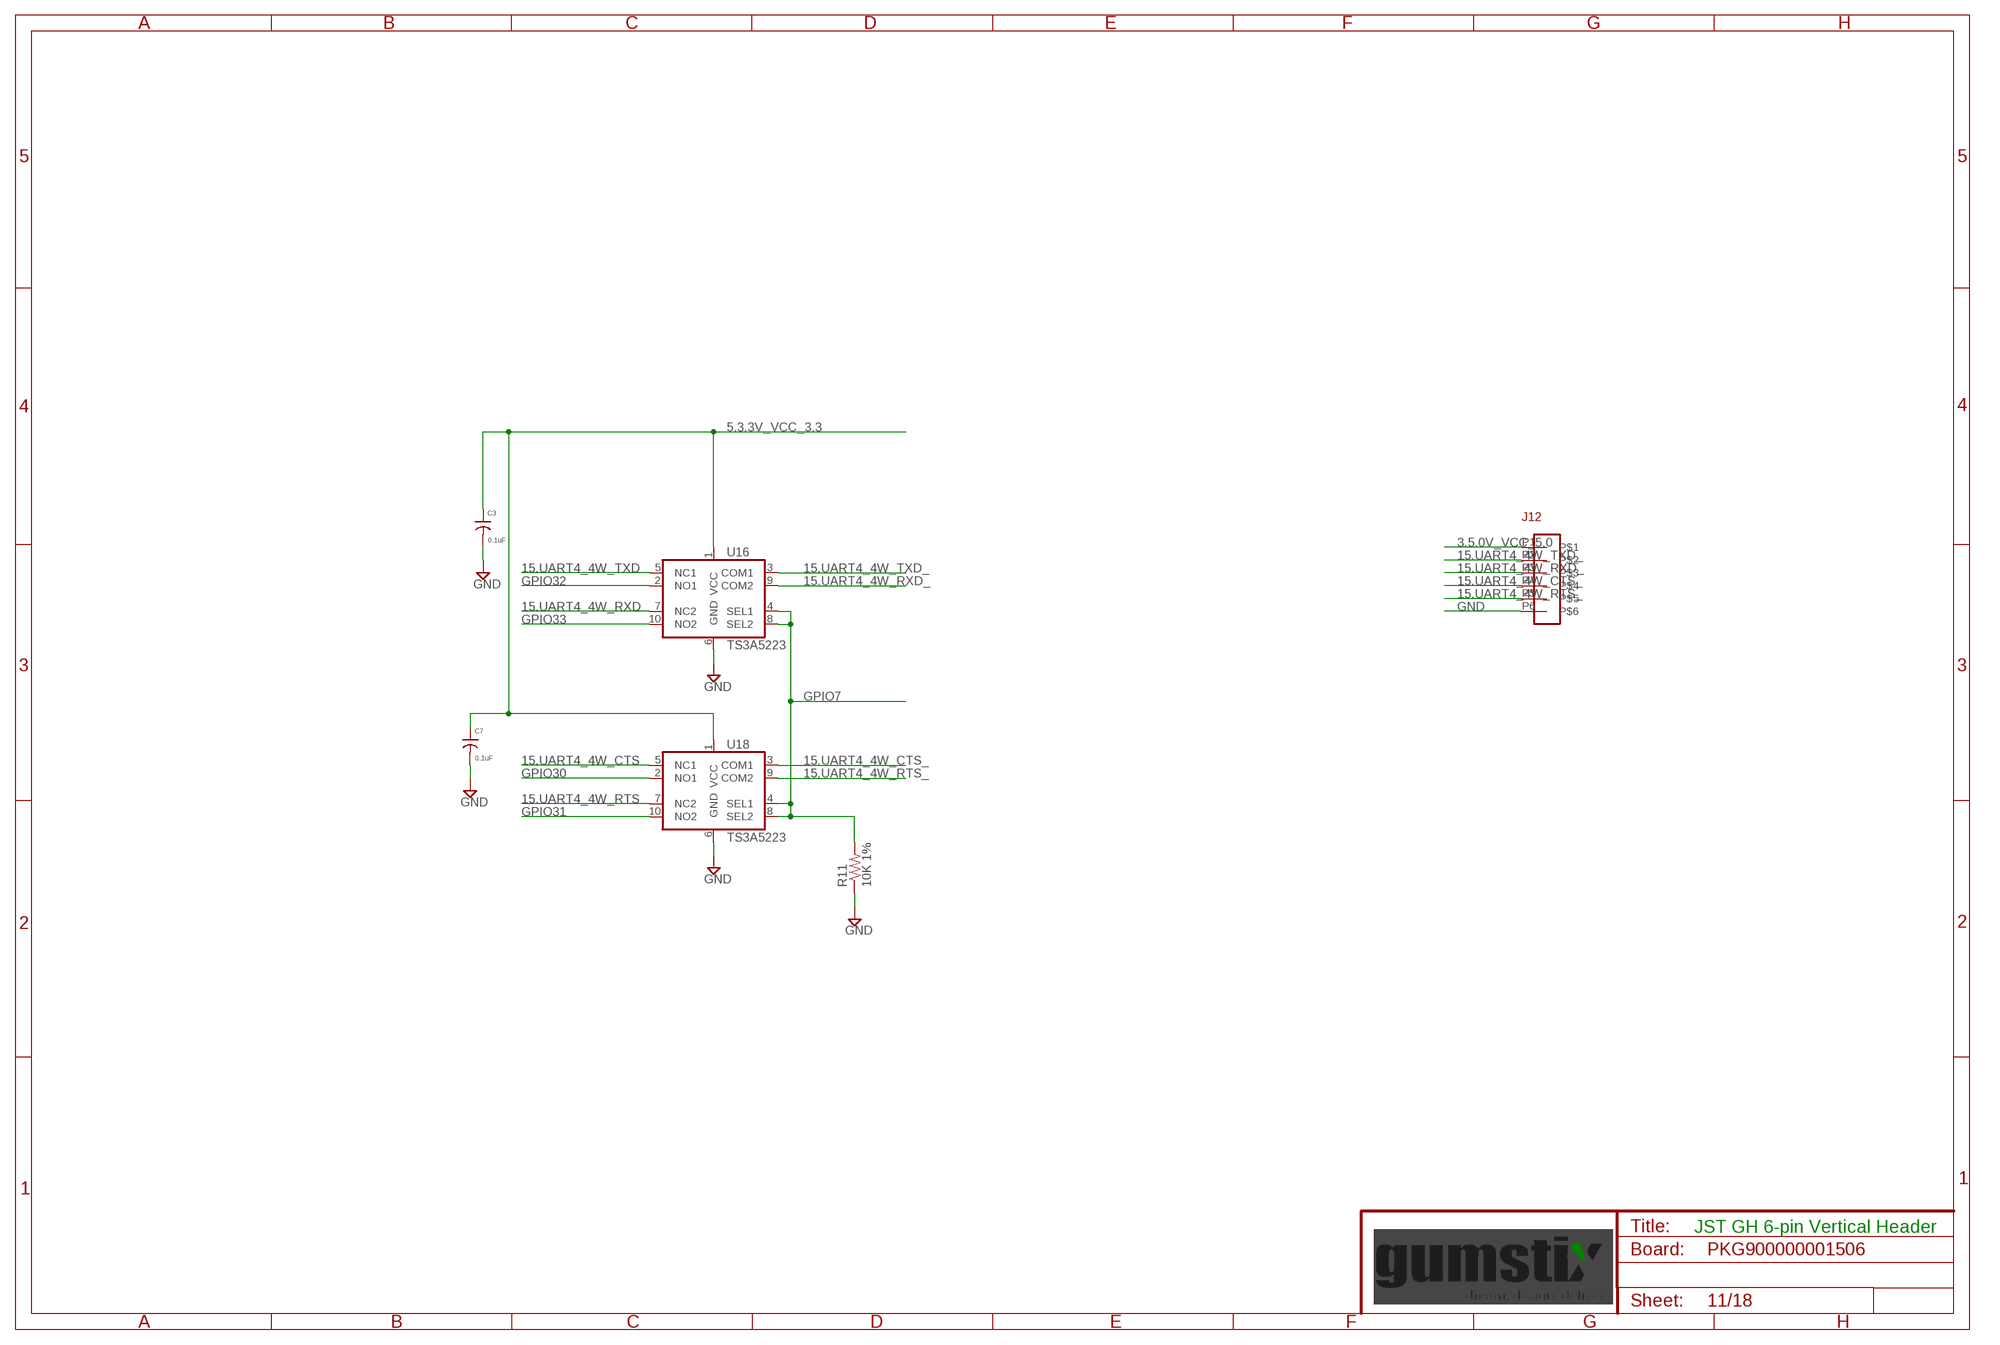
[diagram p10: schematic, sheet 11]

### Parts
C3  0.1uF  C0201  [0201]
C7  0.1uF  C0201  [0201]
J12  JST-GH-6V  [JST-GH-6V]
R11  10K 1%  R0201  [0201]
U16  TS3A5223  [UQFN-10]
U18  TS3A5223  [UQFN-10]

### Nets
3.5.0V_VCC_5.0 [supply]: J12.P1 ; also sheet 4,6,7,8,12,13,16,17
5.3.3V_VCC_3.3 [supply]: C3.1 C7.1 U16.1(VCC) U18.1(VCC) ; also sheet 2,3,6,8,9,10,12,14
15.UART4_4W_CTS: U18.5(NC1) ; also sheet 13
15.UART4_4W_CTS_: J12.P4 U18.3(COM1)
15.UART4_4W_RTS: U18.7(NC2) ; also sheet 13
15.UART4_4W_RTS_: J12.P5 U18.9(COM2)
15.UART4_4W_RXD: U16.7(NC2) ; also sheet 13
15.UART4_4W_RXD_: J12.P3 U16.9(COM2)
15.UART4_4W_TXD: U16.5(NC1) ; also sheet 13
15.UART4_4W_TXD_: J12.P2 U16.3(COM1)
GND [supply]: C3.2 C7.2 J12.P6 R11.1 U16.6(GND) U18.6(GND) ; also sheet 2,3,4,5,6,7,8,9,10,12,13,14,15,16,17,18
GPIO7: R11.2 U16.4(SEL1) U16.8(SEL2) U18.4(SEL1) U18.8(SEL2) ; also sheet 13
GPIO30: U18.2(NO1) ; also sheet 13
GPIO31: U18.10(NO2) ; also sheet 13
GPIO32: U16.2(NO1) ; also sheet 13
GPIO33: U16.10(NO2) ; also sheet 13

### Notes on the sheet
- JST GH 6-pin Vertical Header

## Sheet 12 of 18
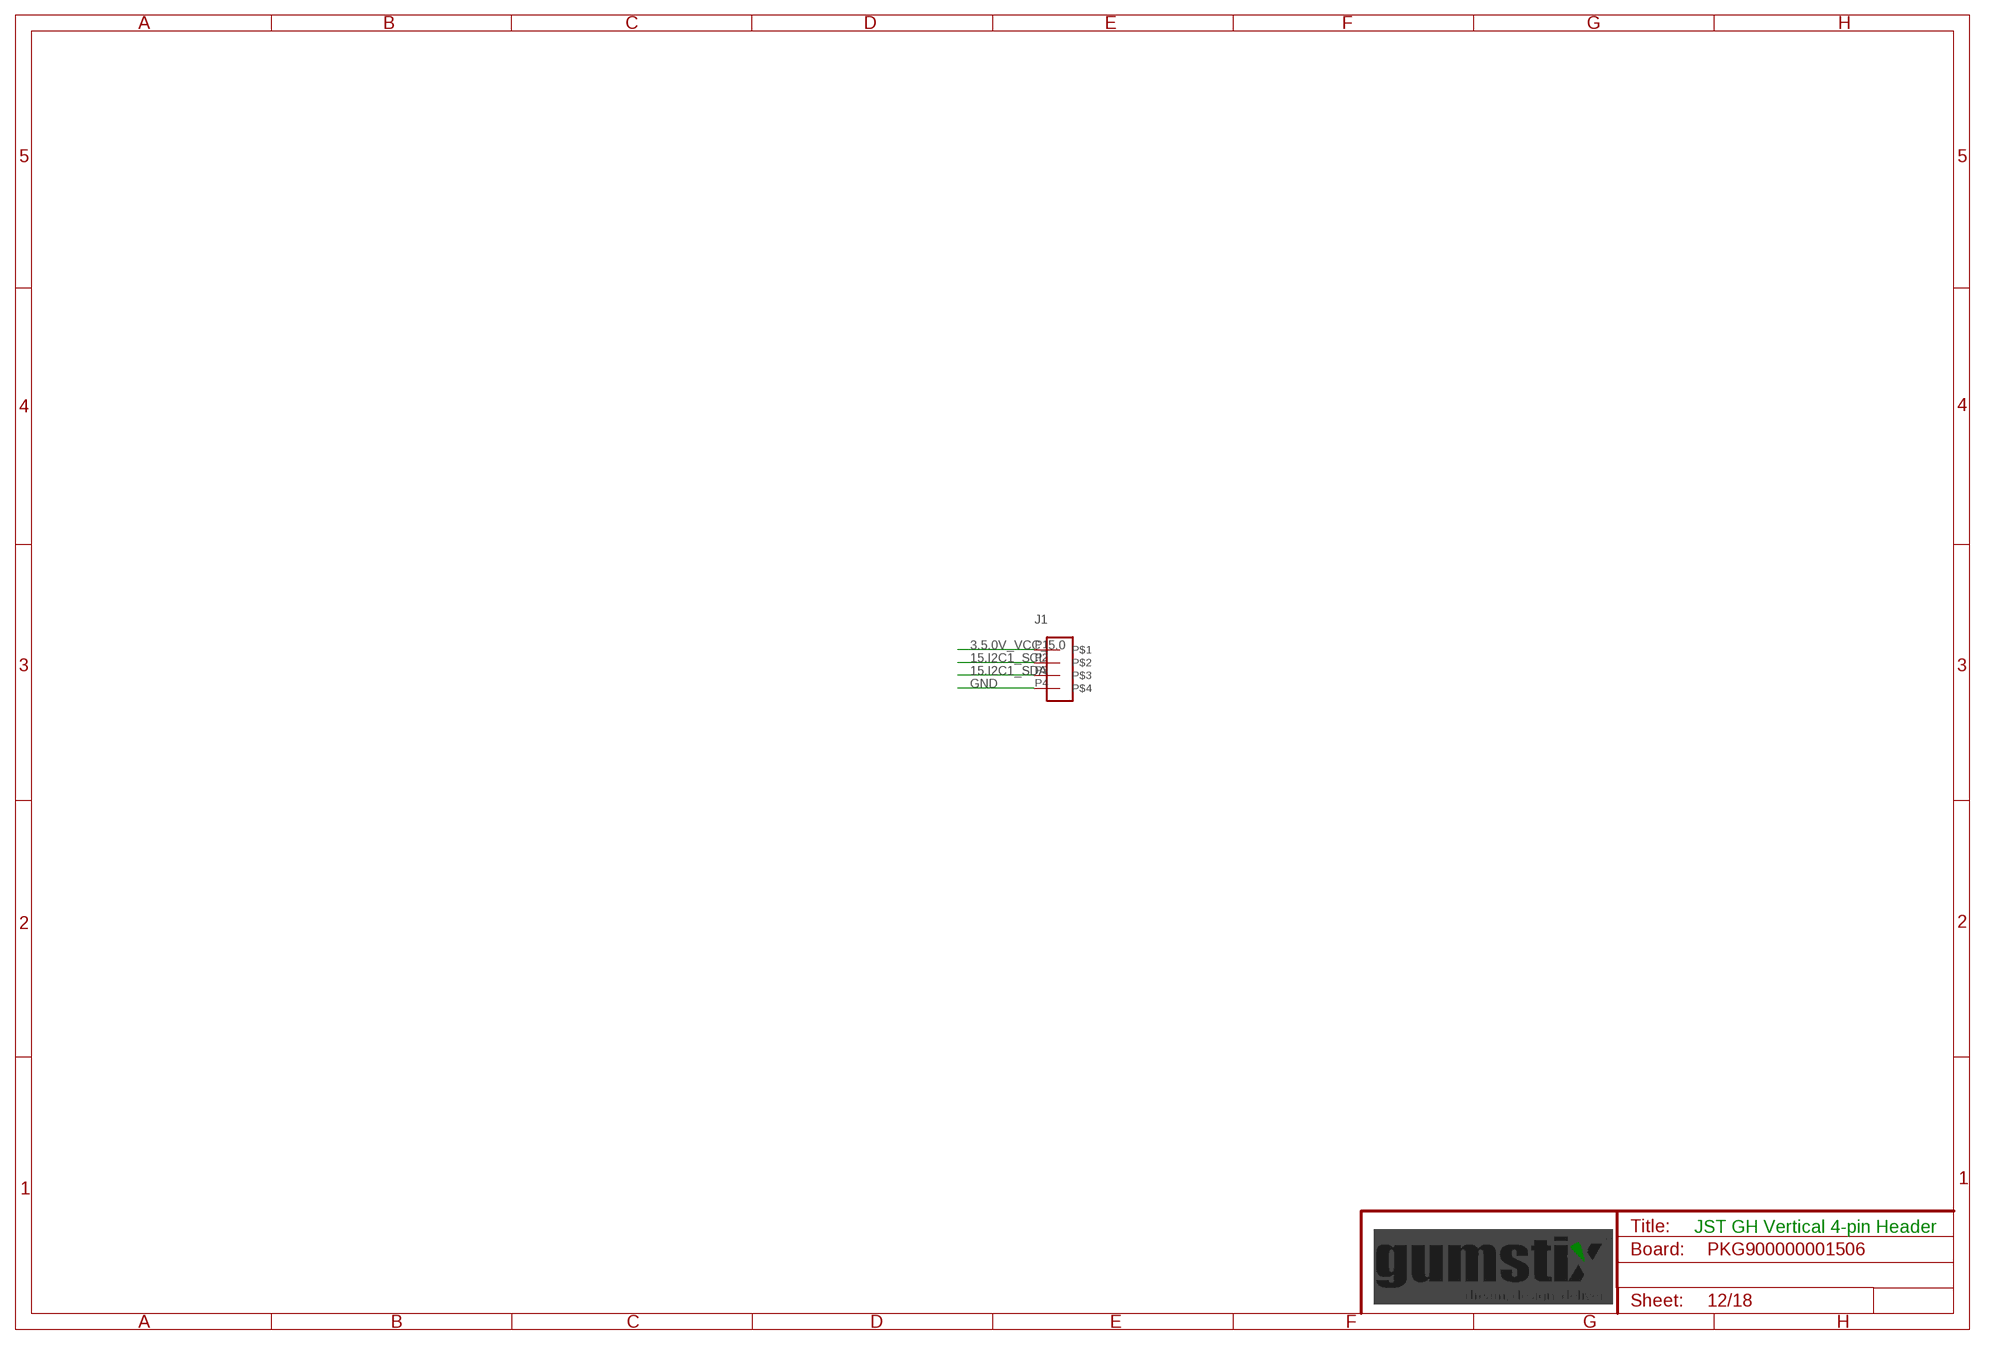
[diagram p11: schematic, sheet 12]

### Parts
J1  JST-GH-4V  [JST-GH-4V]

### Nets
3.5.0V_VCC_5.0 [supply]: J1.P1 ; also sheet 4,6,7,8,11,13,16,17
15.I2C1_SCL: J1.P2 ; also sheet 13
15.I2C1_SDA: J1.P3 ; also sheet 13
GND [supply]: J1.P4 ; also sheet 2,3,4,5,6,7,8,9,10,11,13,14,15,16,17,18

### Notes on the sheet
- JST GH Vertical 4-pin Header

## Sheet 13 of 18
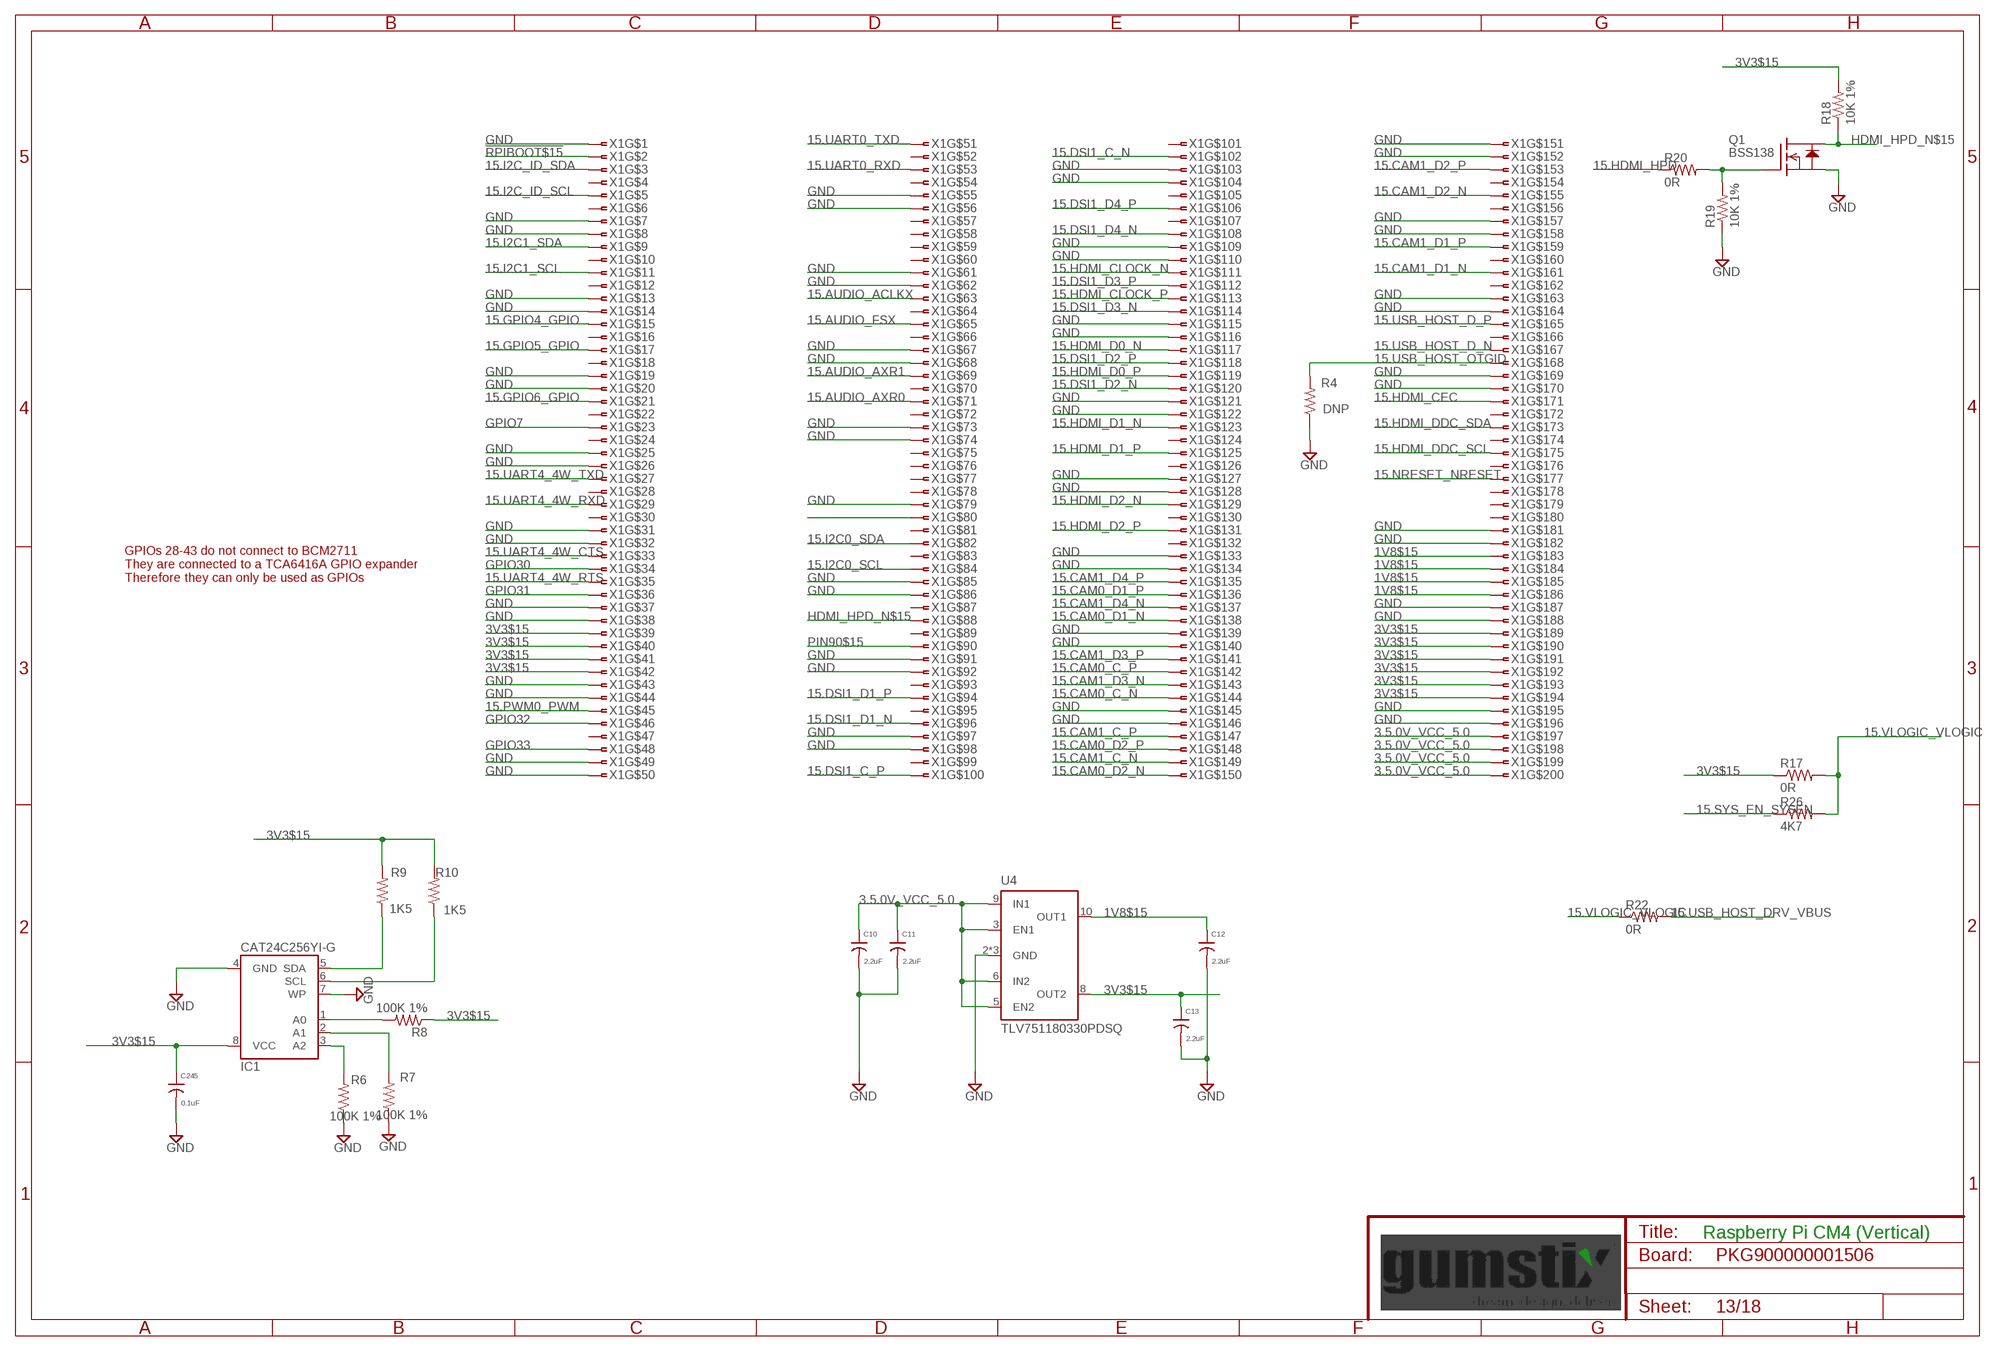
[diagram p12: schematic, sheet 13]

### Parts
C10  2.2uF  C0402  [0402]
C11  2.2uF  C0402  [0402]
C12  2.2uF  C0402  [0402]
C13  2.2uF  C0402  [0402]
C245  0.1uF  C0201  [0201]
IC1  CAT24C256YI-G  AT24CA  [TSSOP8]
Q1  BSS138  [SOT23]
R4  DNP  R0201  [0201]
R6  100K 1%  R0201  [0201]
R7  100K 1%  R0201  [0201]
R8  100K 1%  R0201  [0201]
R9  1K5  R0201  [0201]
R10  1K5  R0201  [0201]
R17  0R  R0201  [0201]
R18  10K 1%  R0201  [0201]
R19  10K 1%  R0201  [0201]
R20  0R  R0201  [0201]
R22  0R  R0201  [0201]
R26  4K7  R0201  [0201]
U4  TLV751180330PDSQ  TLV751  [WFDFN-10]
X1  DM-200P-SODIMM  [DM-200P]

### Nets
1V8$15 [supply]: C12.1 U4.10(OUT1) X1.183 X1.184 X1.185 X1.186
3.5.0V_VCC_5.0 [supply]: C10.1 C11.1 U4.3(EN1) U4.5(EN2) U4.6(IN2) U4.9(IN1) X1.197 X1.198 X1.199 X1.200 ; also sheet 4,6,7,8,11,12,16,17
3V3$15 [supply]: C13.1 C245.1 IC1.8(VCC) R8.1 R9.2 R10.2 R17.1 R18.2 U4.8(OUT2) X1.39 X1.40 X1.41 X1.42 X1.189 X1.190 X1.191 X1.192 X1.193 X1.194
15.AUDIO_ACLKX: X1.63 ; also sheet 14
15.AUDIO_AXR0: X1.71
15.AUDIO_AXR1: X1.69 ; also sheet 14
15.AUDIO_FSX: X1.65 ; also sheet 14
15.CAM0_C_N [HDMI]: X1.144 ; also sheet 2
15.CAM0_C_P [HDMI]: X1.142 ; also sheet 2
15.CAM0_D1_N [HDMI]: X1.138 ; also sheet 2
15.CAM0_D1_P [HDMI]: X1.136 ; also sheet 2
15.CAM0_D2_N [HDMI]: X1.150 ; also sheet 2
15.CAM0_D2_P [HDMI]: X1.148 ; also sheet 2
15.CAM1_C_N [HDMI]: X1.149 ; also sheet 3
15.CAM1_C_P [HDMI]: X1.147 ; also sheet 3
15.CAM1_D1_N [HDMI]: X1.161 ; also sheet 3
15.CAM1_D1_P [HDMI]: X1.159 ; also sheet 3
15.CAM1_D2_N [HDMI]: X1.155 ; also sheet 3
15.CAM1_D2_P [HDMI]: X1.153 ; also sheet 3
15.CAM1_D3_N [HDMI]: X1.143
15.CAM1_D3_P [HDMI]: X1.141
15.CAM1_D4_N [HDMI]: X1.137
15.CAM1_D4_P [HDMI]: X1.135
15.DSI1_C_N [HDMI]: X1.102 ; also sheet 10
15.DSI1_C_P [HDMI]: X1.100 ; also sheet 10
15.DSI1_D1_N [HDMI]: X1.96 ; also sheet 10
15.DSI1_D1_P [HDMI]: X1.94 ; also sheet 10
15.DSI1_D2_N [HDMI]: X1.120 ; also sheet 10
15.DSI1_D2_P [HDMI]: X1.118 ; also sheet 10
15.DSI1_D3_N [HDMI]: X1.114
15.DSI1_D3_P [HDMI]: X1.112
15.DSI1_D4_N [HDMI]: X1.108
15.DSI1_D4_P [HDMI]: X1.106
15.GPIO4_GPIO: X1.15 ; also sheet 2
15.GPIO5_GPIO: X1.17 ; also sheet 3
15.GPIO6_GPIO: X1.21 ; also sheet 18
15.HDMI_CEC: X1.171 ; also sheet 7
15.HDMI_CLOCK_N [HDMI]: X1.111 ; also sheet 7
15.HDMI_CLOCK_P [HDMI]: X1.113 ; also sheet 7
15.HDMI_D0_N [HDMI]: X1.117 ; also sheet 7
15.HDMI_D0_P [HDMI]: X1.119 ; also sheet 7
15.HDMI_D1_N [HDMI]: X1.123 ; also sheet 7
15.HDMI_D1_P [HDMI]: X1.125 ; also sheet 7
15.HDMI_D2_N [HDMI]: X1.129 ; also sheet 7
15.HDMI_D2_P [HDMI]: X1.131 ; also sheet 7
15.HDMI_DDC_SCL: X1.175 ; also sheet 7
15.HDMI_DDC_SDA: X1.173 ; also sheet 7
15.HDMI_HPD: R20.1 ; also sheet 7
15.I2C0_SCL: X1.84 ; also sheet 3,10
15.I2C0_SDA: X1.82 ; also sheet 3,10
15.I2C1_SCL: IC1.6(SCL) R10.1 X1.11 ; also sheet 12
15.I2C1_SDA: IC1.5(SDA) R9.1 X1.9 ; also sheet 12
15.I2C_ID_SCL: X1.5 ; also sheet 2
15.I2C_ID_SDA: X1.3 ; also sheet 2
15.NRESET_NRESET: X1.177 ; also sheet 15
15.PWM0_PWM: X1.45 ; also sheet 17
15.SYS_EN_SYSEN: R26.1 ; also sheet 9
15.UART0_RXD: X1.53 ; also sheet 5
15.UART0_TXD: X1.51 ; also sheet 5
15.UART4_4W_CTS: X1.33 ; also sheet 11
15.UART4_4W_RTS: X1.35 ; also sheet 11
15.UART4_4W_RXD: X1.29 ; also sheet 11
15.UART4_4W_TXD: X1.27 ; also sheet 11
15.USB_HOST_D_N [USB]: X1.167 ; also sheet 8
15.USB_HOST_D_P [USB]: X1.165 ; also sheet 8
15.USB_HOST_DRV_VBUS: R22.2 ; also sheet 8
15.USB_HOST_OTGID: R4.2 X1.168
15.VLOGIC_VLOGIC [supply]: R17.2 R22.1 R26.2 ; also sheet 5,7,11,12,15,17,18
!RPIBOOT$15: X1.2
A0$15: IC1.1(A0) R8.2
A1$15: IC1.2(A1) R7.2
A2$15: IC1.3(A2) R6.2
GND [supply]: C10.2 C11.2 C12.2 C13.2 C245.2 IC1.4(GND) IC1.7(WP) Q1.2(S) R4.1 R6.1 R7.1 R19.1 U4.2(GND) U4.4(GND) U4.PAD(GND) X1.1 X1.7 X1.8 X1.13 X1.14 X1.19 X1.20 X1.25 X1.26 X1.31 X1.32 X1.37 X1.38 X1.43 X1.44 X1.49 X1.50 X1.55 X1.56 X1.61 X1.62 X1.67 X1.68 X1.73 X1.74 X1.79 X1.80 X1.85 X1.86 X1.91 X1.92 X1.97 X1.98 X1.103 X1.104 X1.109 X1.110 X1.115 X1.116 X1.121 X1.122 X1.127 X1.128 X1.133 X1.134 X1.139 X1.140 X1.145 X1.146 X1.151 X1.152 X1.157 X1.158 X1.163 X1.164 X1.169 X1.170 X1.181 X1.182 X1.187 X1.188 X1.195 X1.196 ; also sheet 2,3,4,5,6,7,8,9,10,11,12,14,15,16,17,18
GPIO7: X1.23 ; also sheet 11
GPIO30: X1.34 ; also sheet 11
GPIO31: X1.36 ; also sheet 11
GPIO32: X1.46 ; also sheet 11
GPIO33: X1.48 ; also sheet 11
HDMI_HPD_N$15: Q1.3(D) R18.1 X1.88
HPD_GATE$15: Q1.1(G) R19.2 R20.2
PIN90$15: X1.90
Unconnected: X1.4 X1.6 X1.10 X1.12 X1.16 X1.18 X1.22 X1.24 X1.28 X1.30 X1.47 X1.52 X1.54 X1.57 X1.58 X1.59 X1.60 X1.64 X1.66 X1.70 X1.72 X1.75 X1.76 X1.77 X1.78 X1.81 X1.83 X1.87 X1.89 X1.93 X1.95 X1.99 X1.101 X1.105 X1.107 X1.124 X1.126 X1.130 X1.132 X1.154 X1.156 X1.160 X1.162 X1.166 X1.172 X1.174 X1.176 X1.178 X1.179 X1.180

### Notes on the sheet
- GPIOs 28-43 do not connect to BCM2711
  They are connected to a TCA6416A GPIO expander
  Therefore they can only be used as GPIOs
- Raspberry Pi CM4 (Vertical)

## Sheet 14 of 18
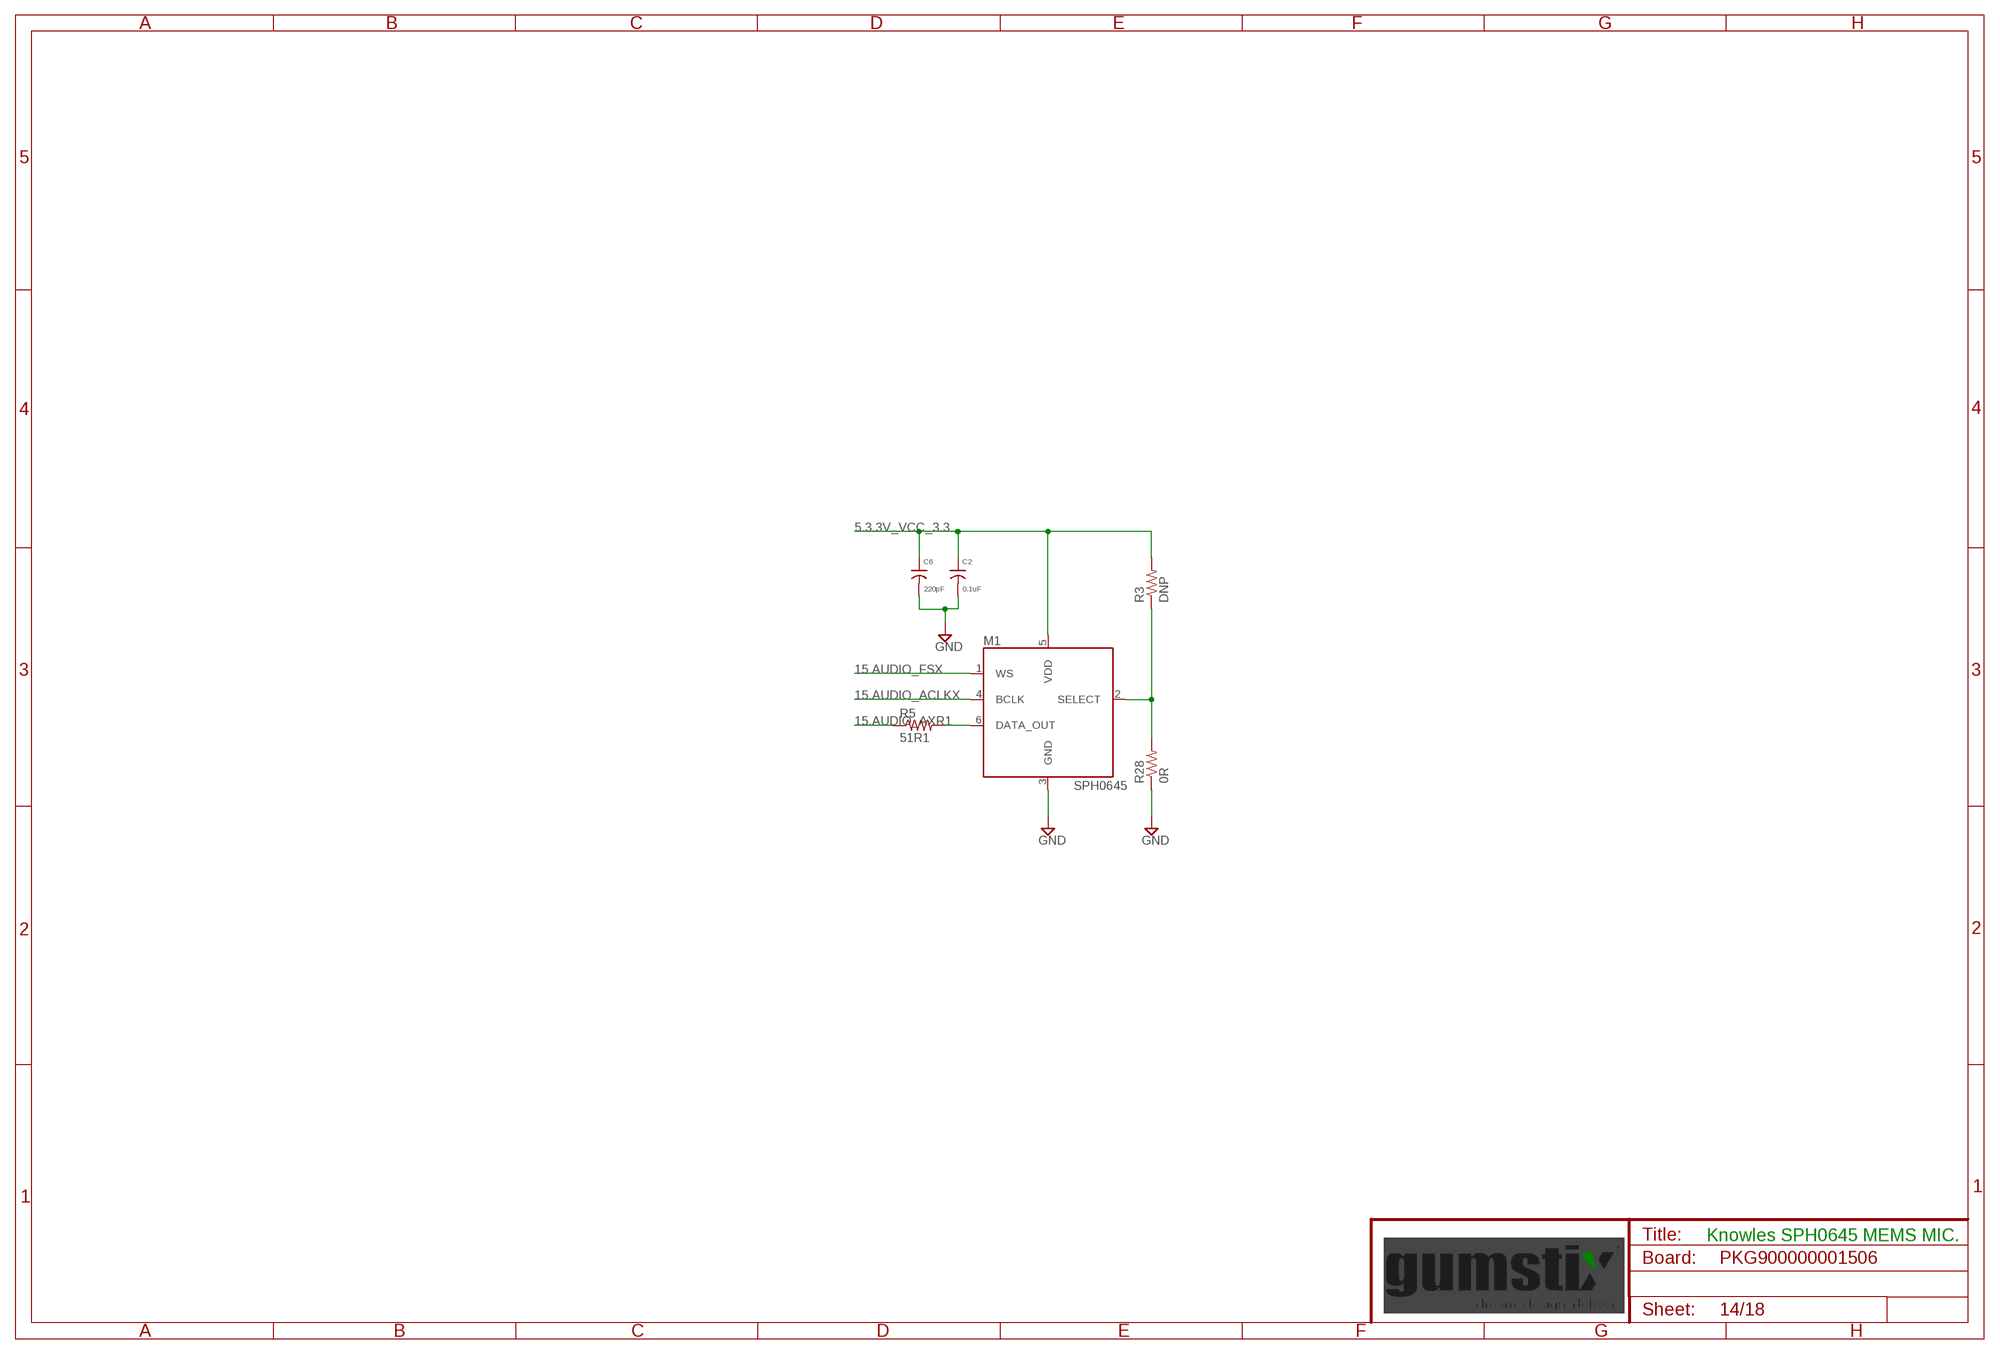
[diagram p13: schematic, sheet 14]

### Parts
C2  0.1uF  C0201  [0201]
C6  220pF  C0201  [0201]
M1  SPH0645  SPH0645LM4H-B  [SPH0645]
R3  DNP  R0201  [0201]
R5  51R1  R0402  [0402]
R28  0R  R0201  [0201]

### Nets
5.3.3V_VCC_3.3 [supply]: C2.1 C6.1 M1.5(VDD) R3.2 ; also sheet 2,3,6,8,9,10,11,12
15.AUDIO_ACLKX: M1.4(BCLK) ; also sheet 13
15.AUDIO_AXR1: R5.1 ; also sheet 13
15.AUDIO_FSX: M1.1(WS) ; also sheet 13
GND [supply]: C2.2 C6.2 M1.3(GND) R28.1 ; also sheet 2,3,4,5,6,7,8,9,10,11,12,13,15,16,17,18
SDI$16: M1.6(DATA_OUT) R5.2
SELECT$16: M1.2(SELECT) R3.1 R28.2

### Notes on the sheet
- Knowles SPH0645 MEMS MIC.

## Sheet 15 of 18
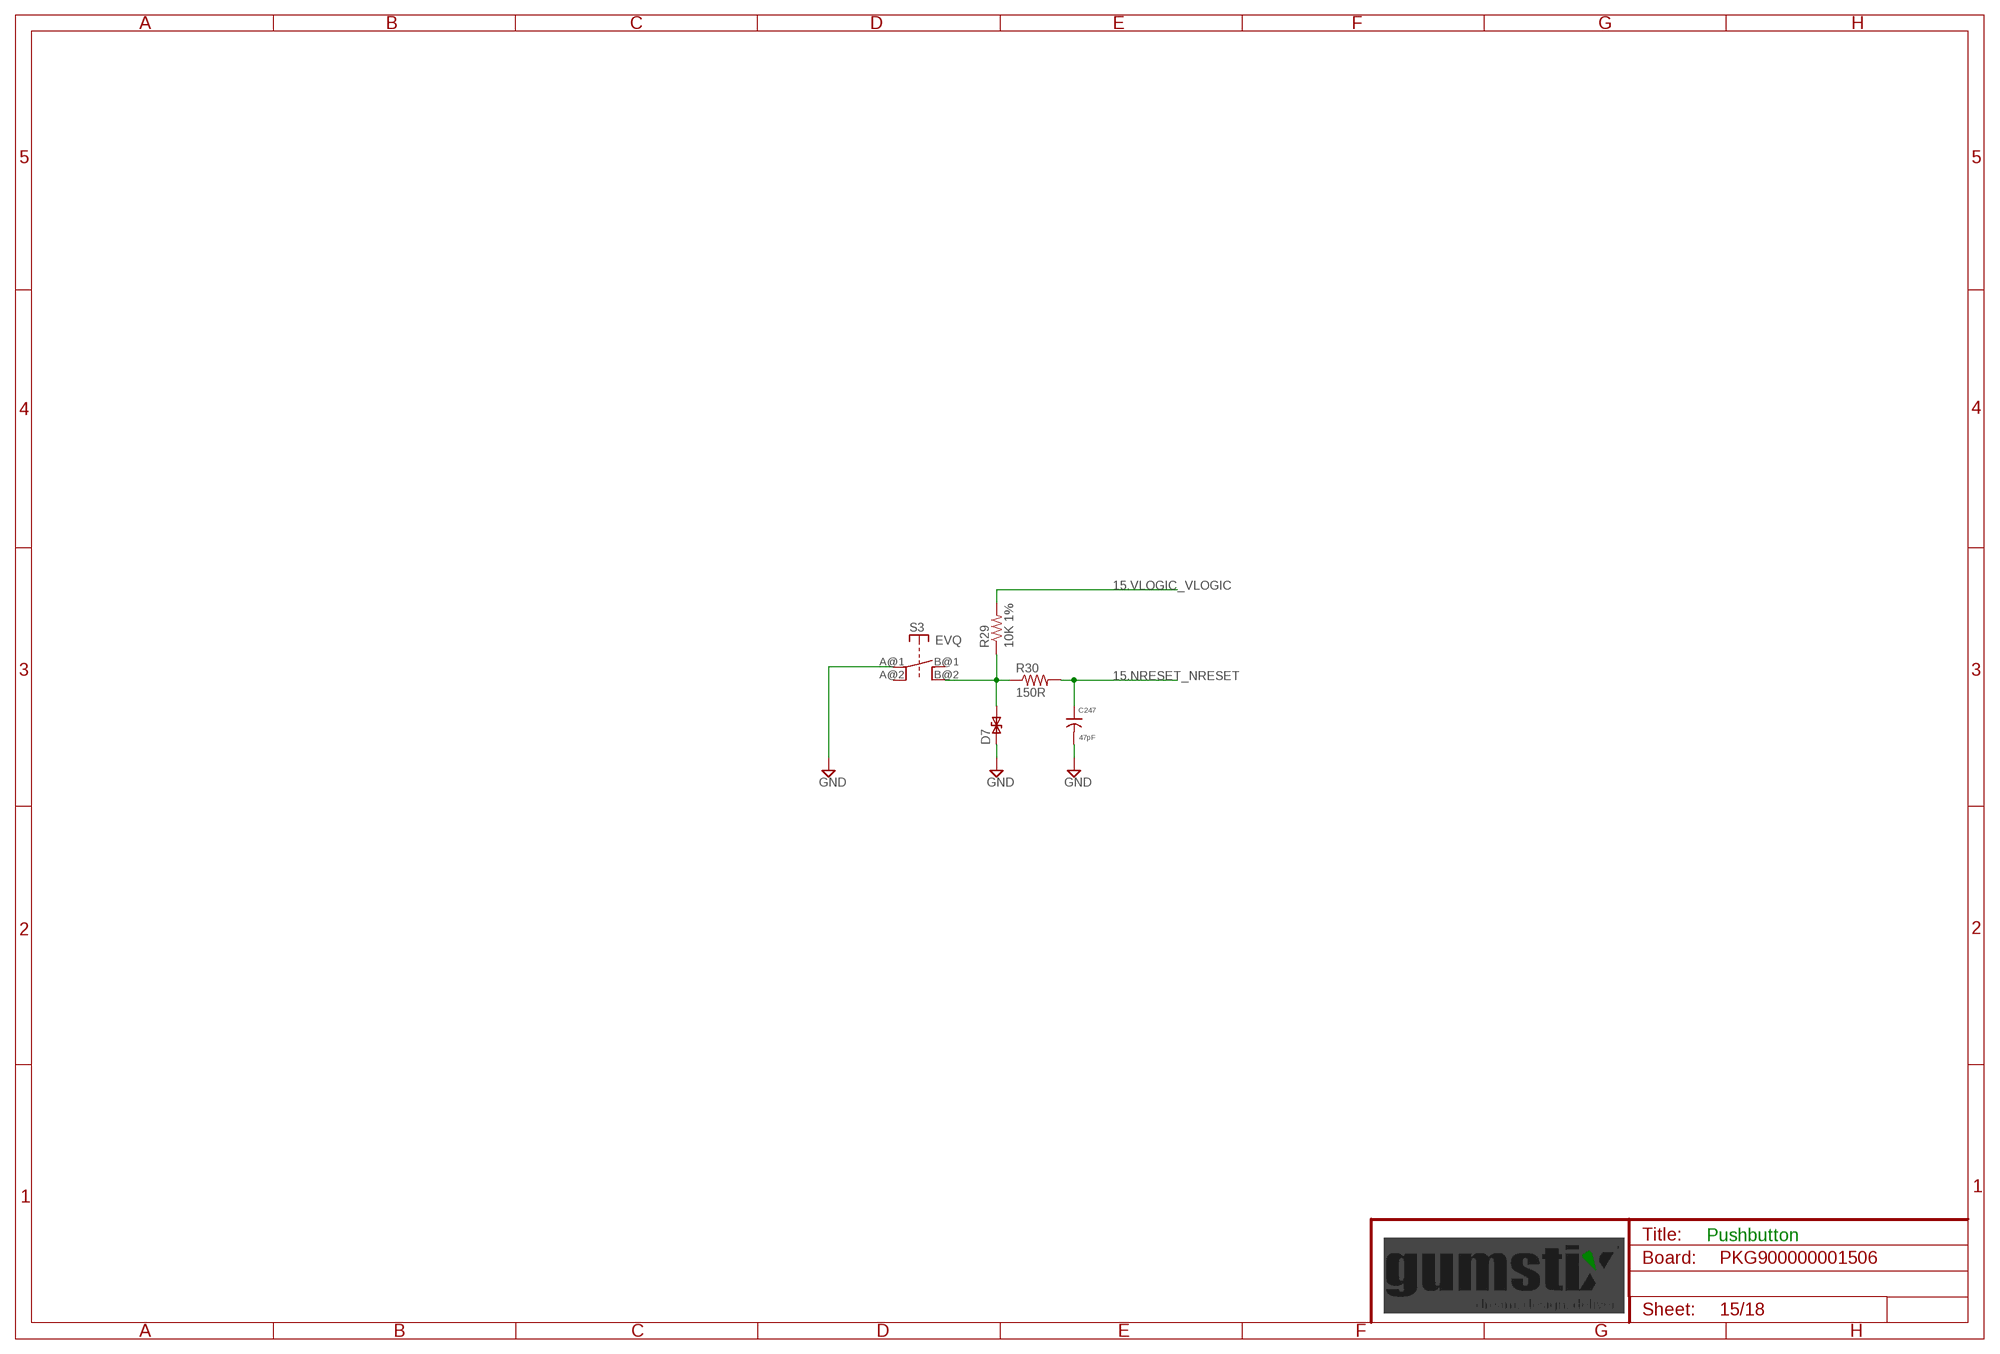
[diagram p14: schematic, sheet 15]

### Parts
C247  47pF  C0201  [0201]
D7  B72590D50A060  ESD-DIODE  [D0402]
R29  10K 1%  R0201  [0201]
R30  150R  R0201  [0201]
S3  EVQ  [EVQ]

### Nets
15.NRESET_NRESET: C247.1 R30.2 ; also sheet 13
15.VLOGIC_VLOGIC [supply]: R29.2 ; also sheet 5,7,11,12,13,17,18
BTN_A$17: D7.P2 R29.1 R30.1 S3.B@2(B')
GND [supply]: C247.2 D7.P1 S3.A@1(A) ; also sheet 2,3,4,5,6,7,8,9,10,11,12,13,14,16,17,18
Unconnected: S3.A@2(A') S3.B@1(B)

### Notes on the sheet
- Pushbutton

## Sheet 16 of 18
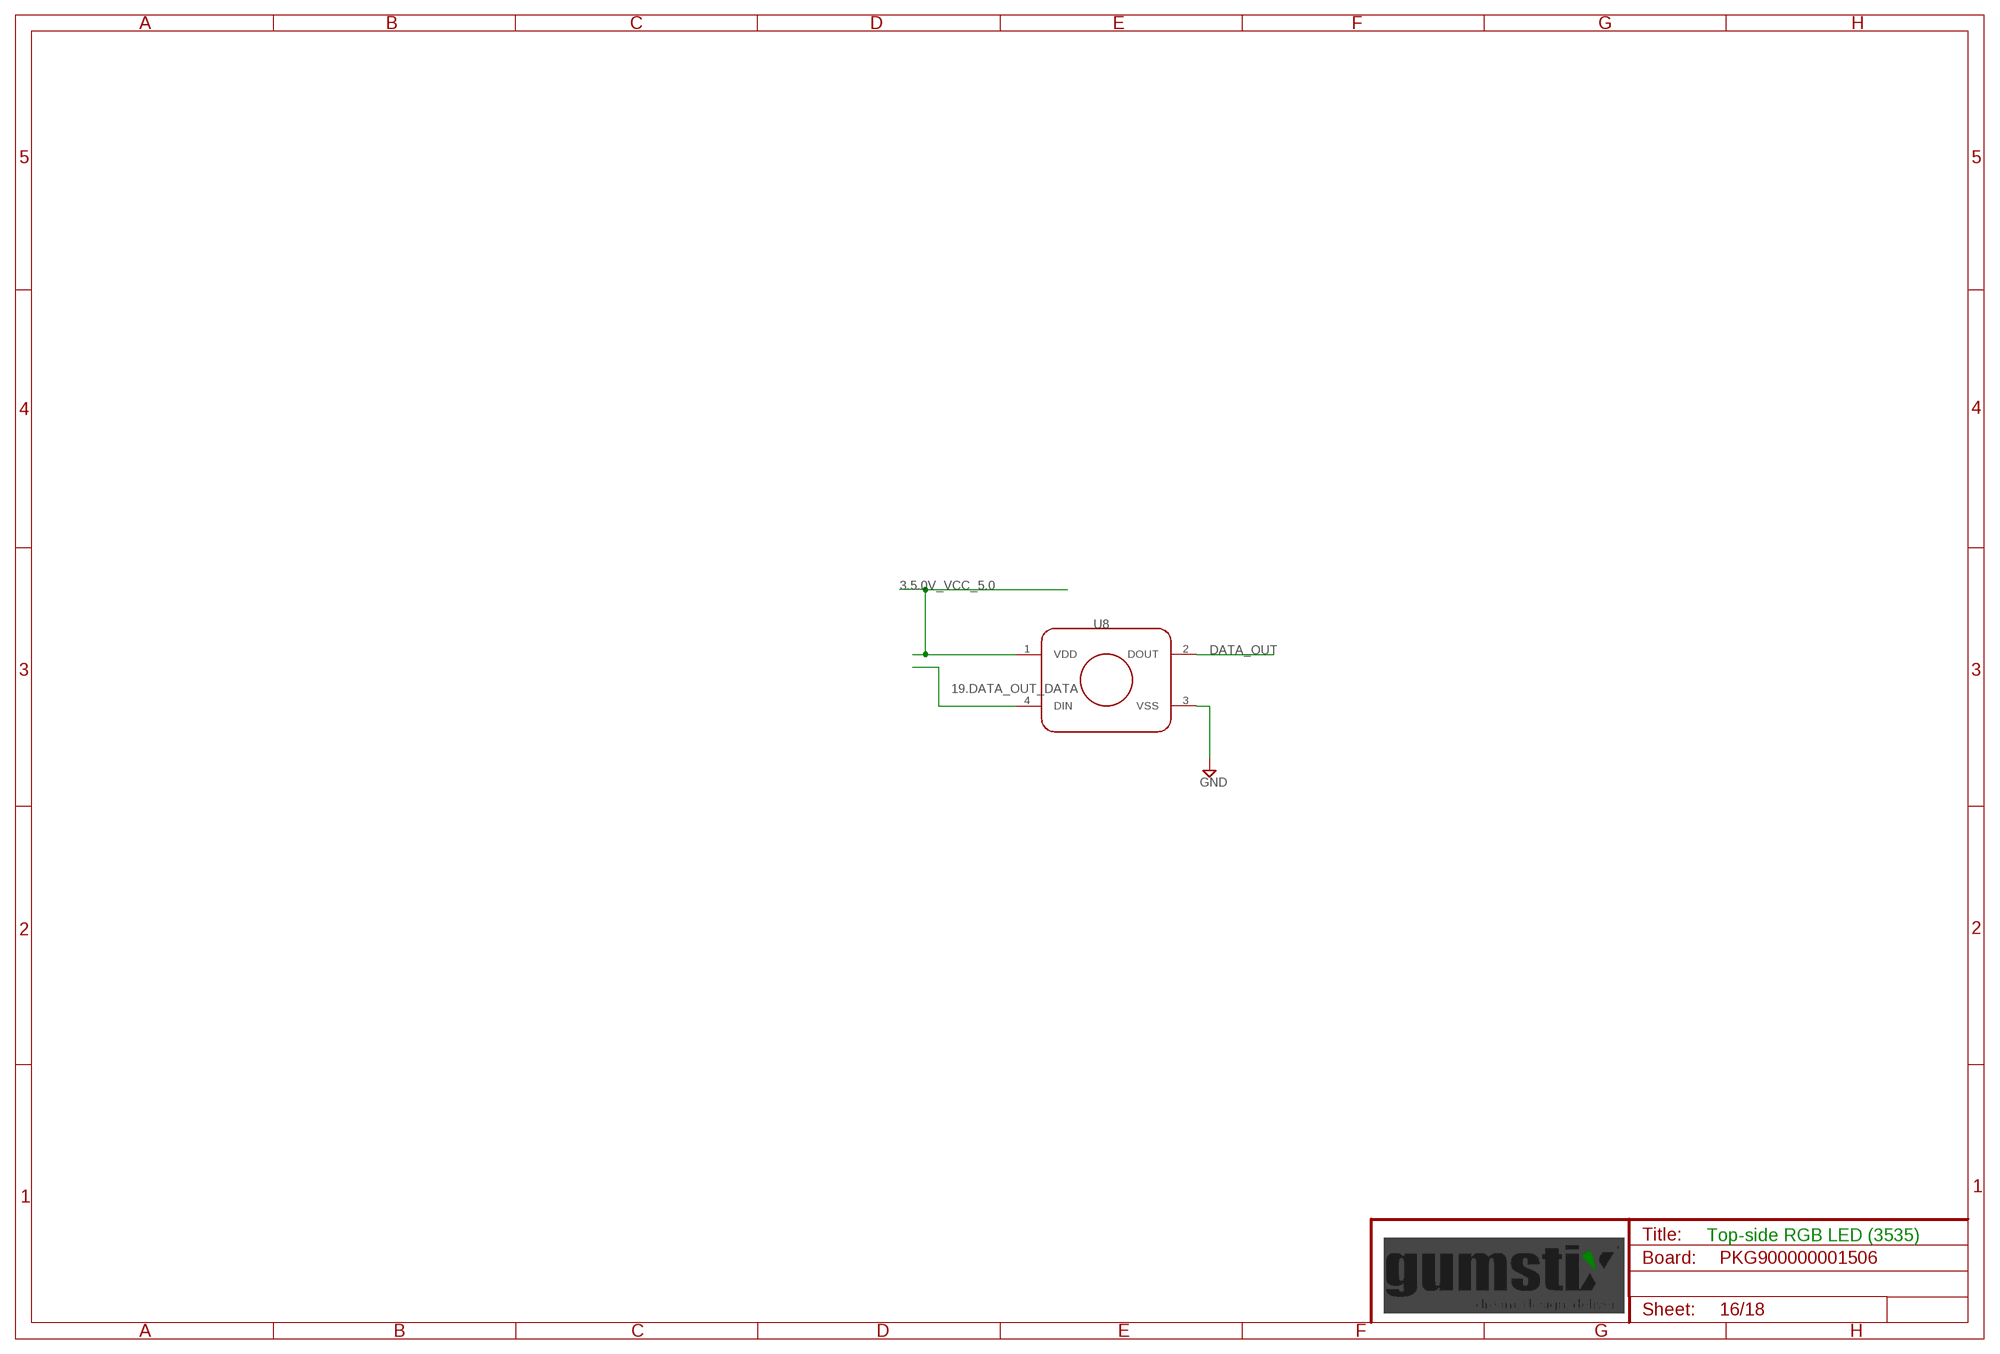
[diagram p15: schematic, sheet 16]

### Parts
U8  WS2812B-Mini-V3  SK6812MINI  [WS2812B-MINI]

### Nets
3.5.0V_VCC_5.0 [supply]: U8.1(VDD) ; also sheet 4,6,7,8,11,12,13,17
19.DATA_OUT_DATA: U8.4(DIN) ; also sheet 17
DATA_OUT: U8.2(DOUT)
GND [supply]: U8.3(VSS) ; also sheet 2,3,4,5,6,7,8,9,10,11,12,13,14,15,17,18

### Notes on the sheet
- Top-side RGB LED (3535)

## Sheet 17 of 18
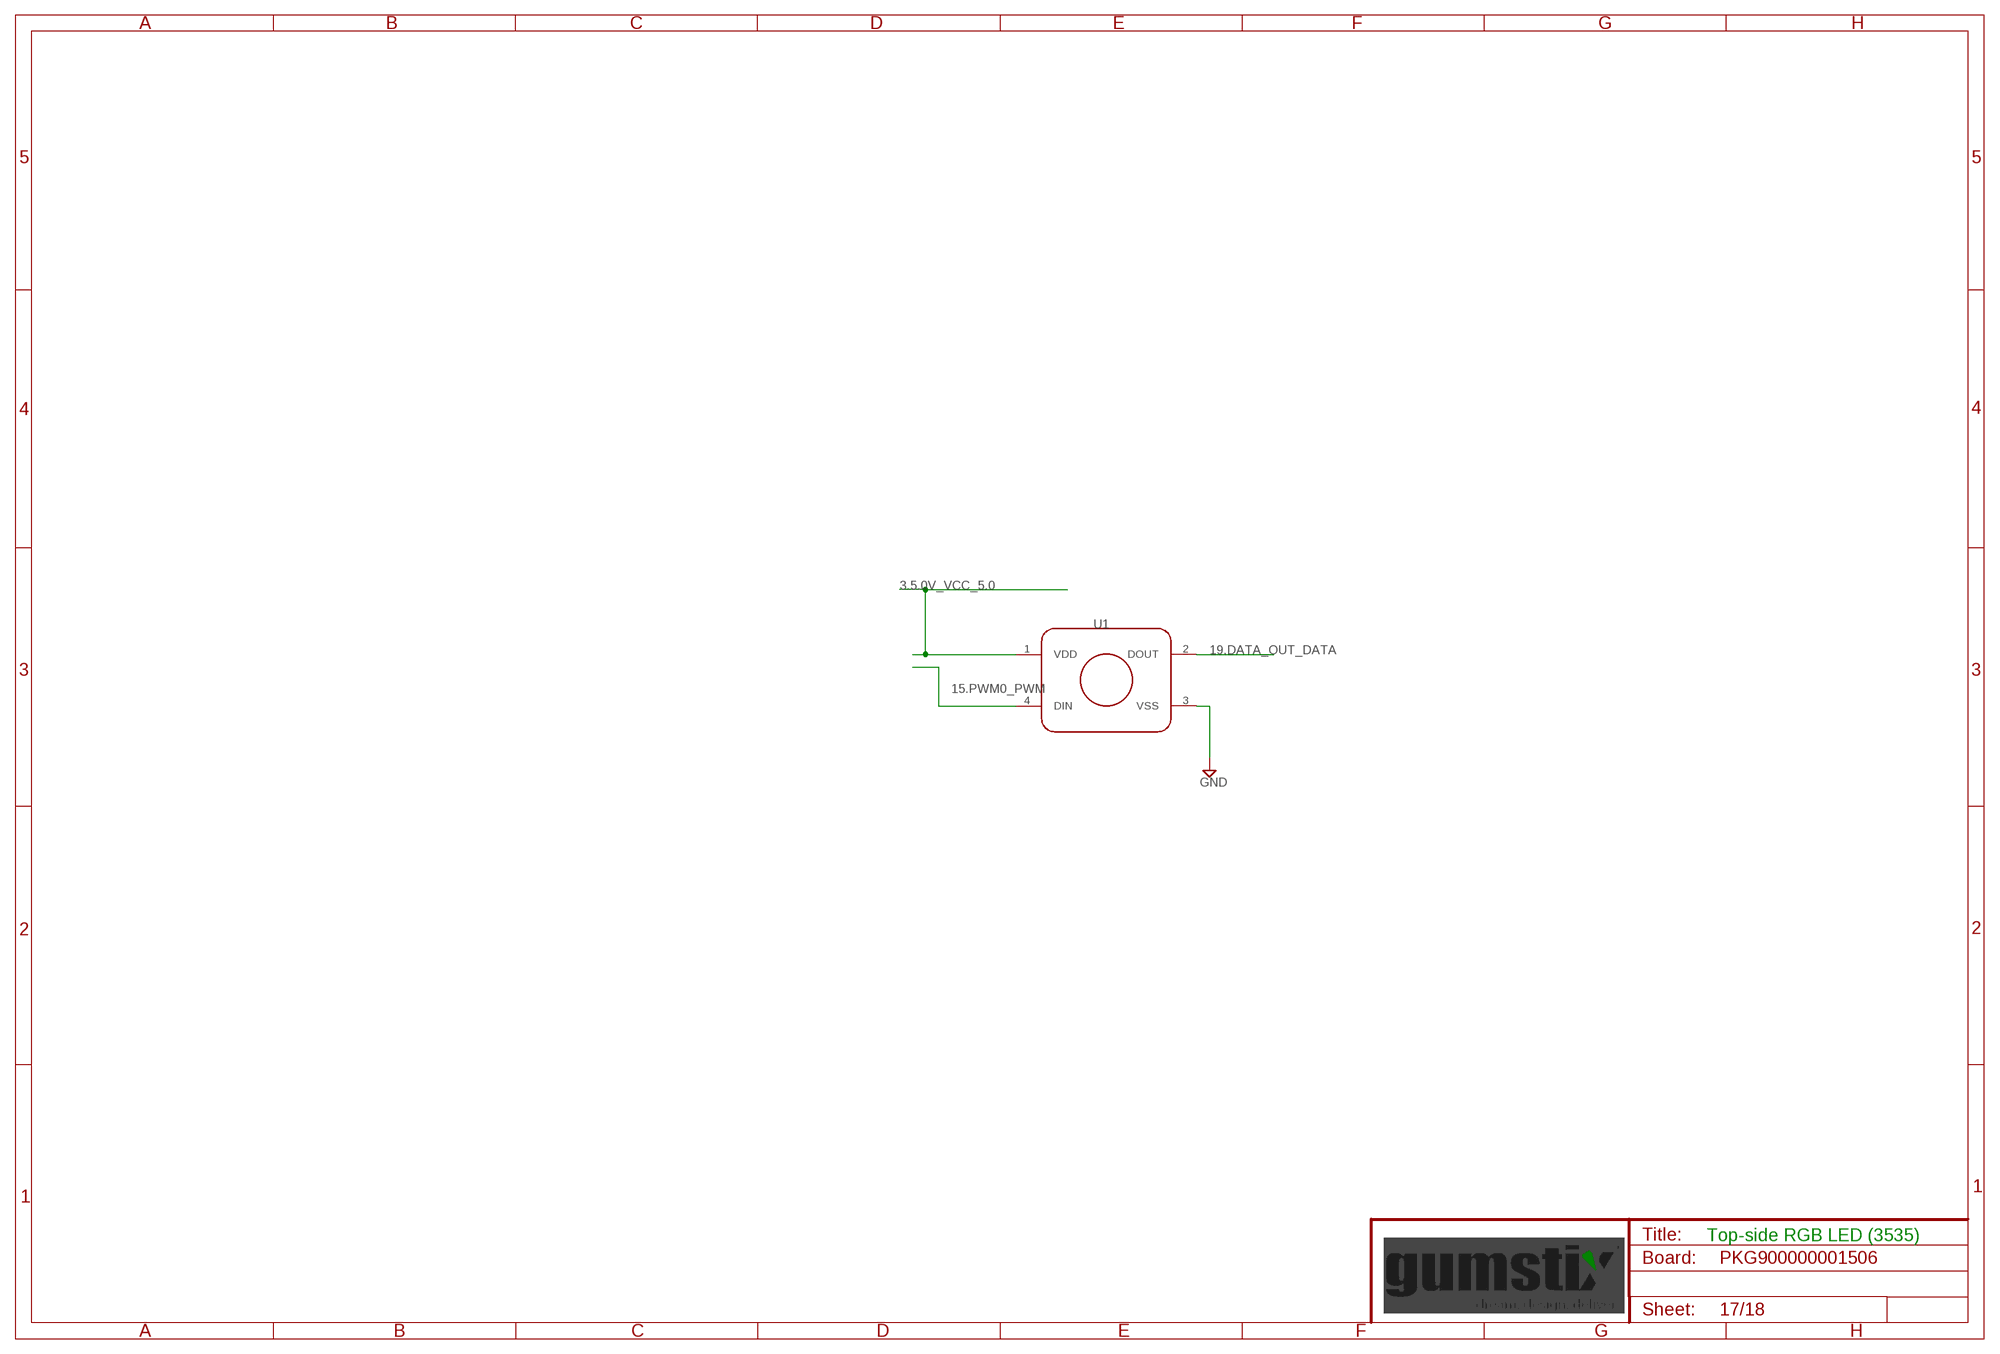
[diagram p16: schematic, sheet 17]

### Parts
U1  WS2812B-Mini-V3  SK6812MINI  [WS2812B-MINI]

### Nets
3.5.0V_VCC_5.0 [supply]: U1.1(VDD) ; also sheet 4,6,7,8,11,12,13,16
15.PWM0_PWM: U1.4(DIN) ; also sheet 13
19.DATA_OUT_DATA: U1.2(DOUT) ; also sheet 16
GND [supply]: U1.3(VSS) ; also sheet 2,3,4,5,6,7,8,9,10,11,12,13,14,15,16,18

### Notes on the sheet
- Top-side RGB LED (3535)

## Sheet 18 of 18
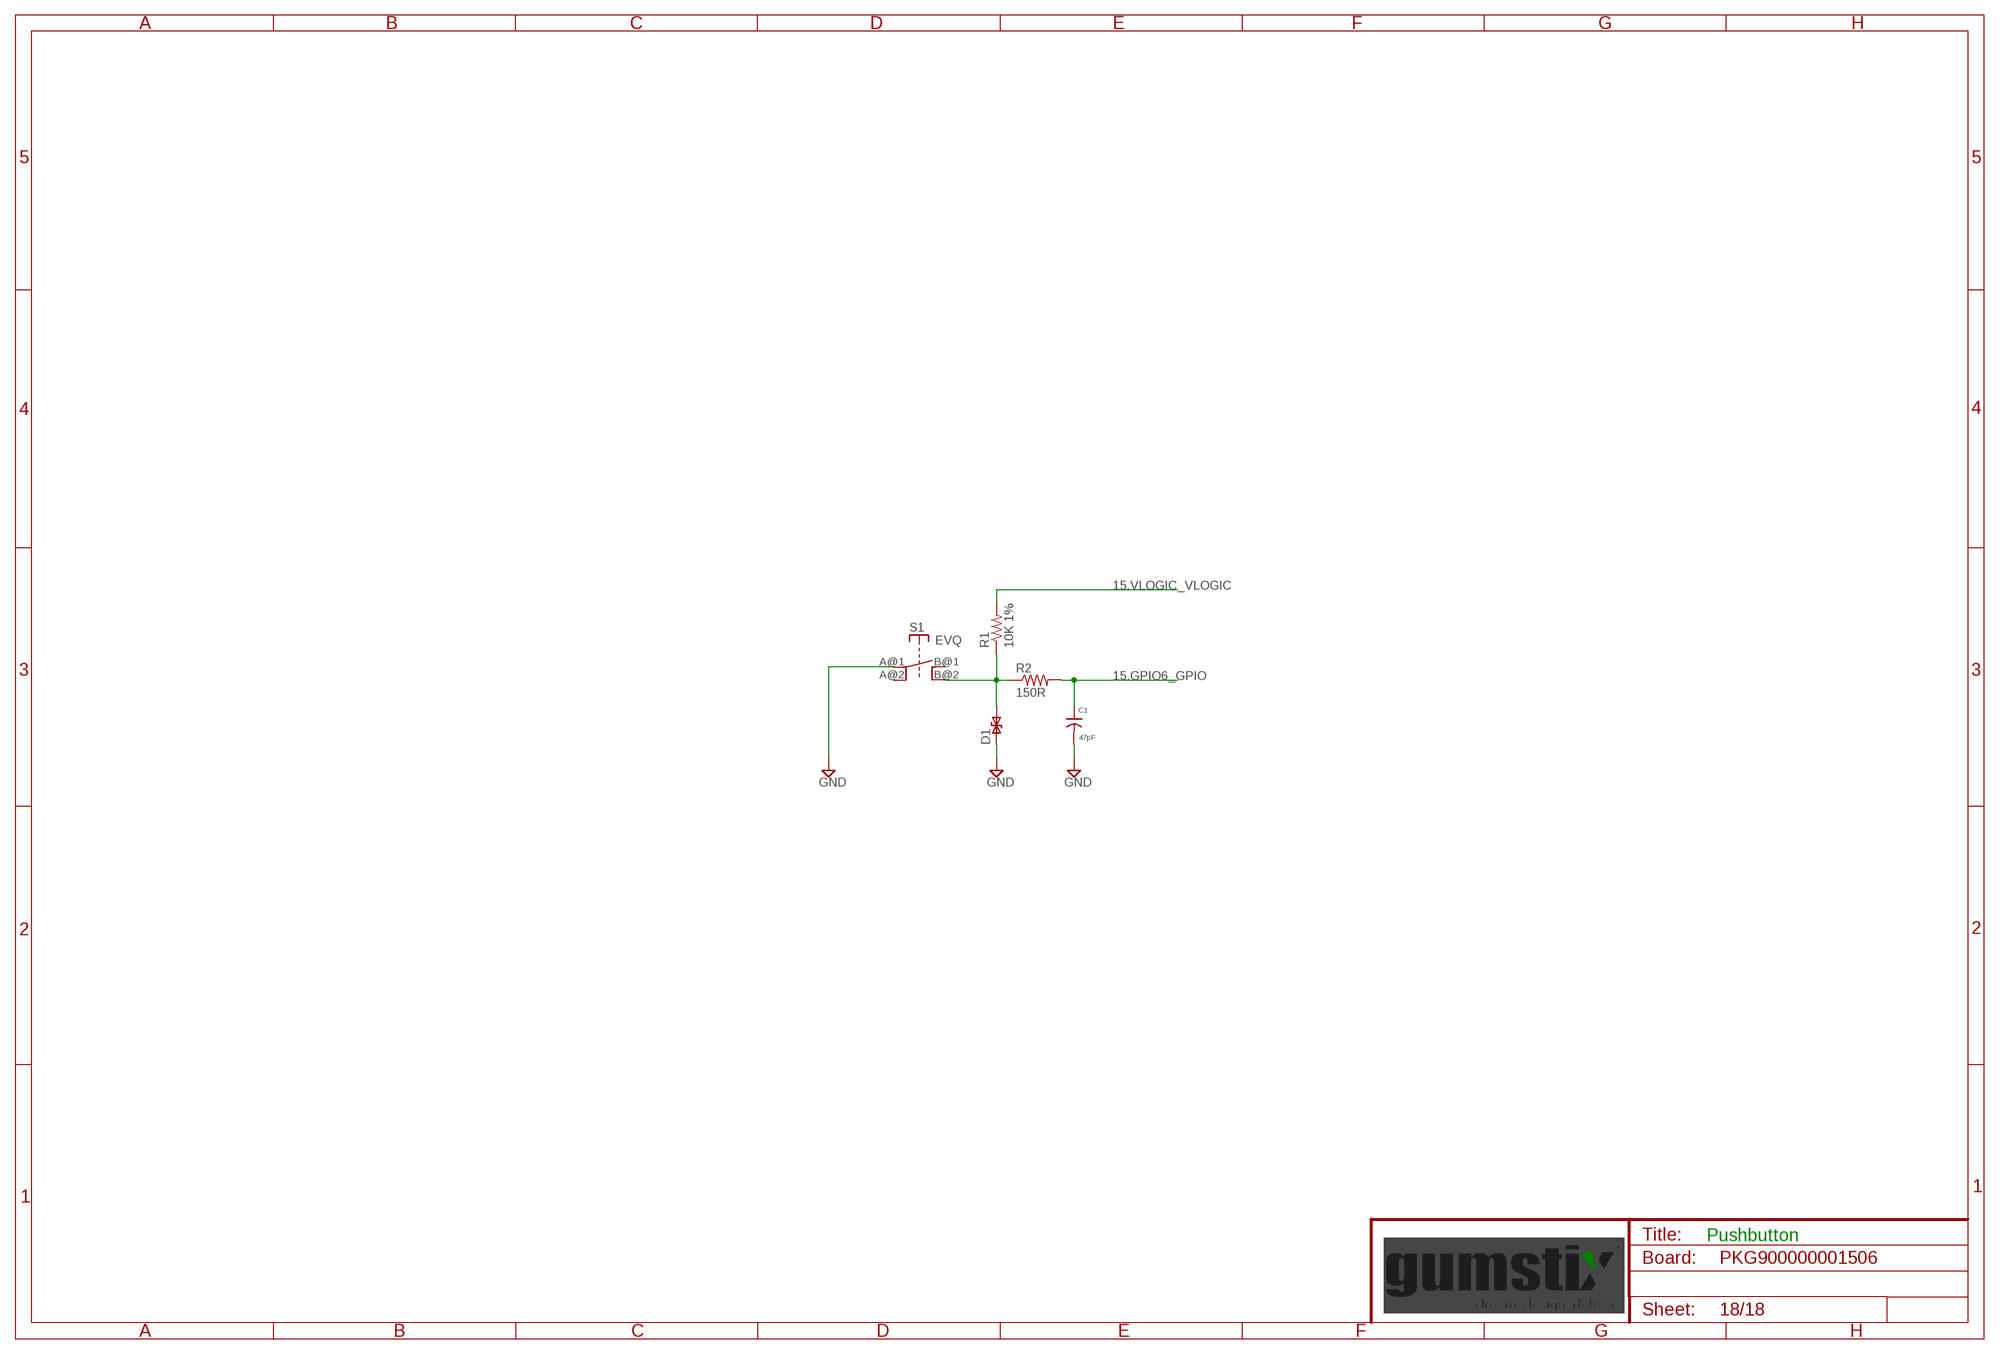
[diagram p17: schematic, sheet 18]

### Parts
C1  47pF  C0201  [0201]
D1  B72590D50A060  ESD-DIODE  [D0402]
R1  10K 1%  R0201  [0201]
R2  150R  R0201  [0201]
S1  EVQ  [EVQ]

### Nets
15.GPIO6_GPIO: C1.1 R2.2 ; also sheet 13
15.VLOGIC_VLOGIC [supply]: R1.2 ; also sheet 5,7,11,12,13,15,17
BTN_A$20: D1.P2 R1.1 R2.1 S1.B@2(B')
GND [supply]: C1.2 D1.P1 S1.A@1(A) ; also sheet 2,3,4,5,6,7,8,9,10,11,12,13,14,15,16,17
Unconnected: S1.A@2(A') S1.B@1(B)

### Notes on the sheet
- Pushbutton

## Library data of the parts
C1-C7 C235 C240 C241 C245 C247 = qualified_1:C; HEIGHT: 0.25
C10-C13 C226 C234 = qualified_1:C; HEIGHT: 0.35
C15 C237-C239 C243 = qualified_1:C; DM: 0; DR: 0.000; DX: 30.550; DY: 33.500; HEIGHT: 0.25; SHEETNO: 6
C227 C229 = qualified_1:C; DM: 0; DR: 90.000; DX: 64.700; DY: 10.600; HEIGHT: 0.25; SHEETNO: 4
C228 = qualified_1:C; DM: 0; DR: 0.000; DX: 66.900; DY: 11.100; HEIGHT: 0.5; SHEETNO: 4
C230 = qualified_1:C; DM: 0; DR: 0.000; DX: 58.600; DY: 19.050; HEIGHT: 0.25; SHEETNO: 4
C231 = qualified_1:C; DM: 0; DR: 0.000; DX: 66.300; DY: 12.650; HEIGHT: 0.25; SHEETNO: 4
C232 = qualified_1:C; DM: 0; DR: -90.000; DX: 1.400; DY: -9.000; HEIGHT: 0.35; SHEETNO: 9
C233 = qualified_1:C; DM: 0; DR: 0.000; DX: 74.600; DY: 25.600; HEIGHT: 0.51; SHEETNO: 1
C236 = qualified_1:C; DM: 0; DR: 270.000; DX: 71.300; DY: 21.800; HEIGHT: 0.51; SHEETNO: 1
C242 = qualified_1:C; DM: 0; DR: 90.000; DX: 13.200; DY: 27.200; HEIGHT: 0.51; SHEETNO: 2
D1-D5 D7 = qualified_1:ESD-DIODE; HEIGHT: 0.35
D6 = qualified_1:LED; HEIGHT: 0.5
FB1 FB2 = qualified_1:FB; DM: 0; DR: 90.000; DX: 11.200; DY: 28.400; HEIGHT: 0.35; SHEETNO: 2
FB3 = qualified_1:FB; DM: 0; DR: 0.000; DX: 56.400; DY: 28.200; HEIGHT: 0.35; SHEETNO: 2
FD1-FD8 = qualified_1:FIDUCIAL; HEIGHT: 0
IC1 = qualified_1:AT24C*: 2-wire serial EEPROM; HEIGHT: 1
IC2 = qualified_1:74*1G126: Single Bus Buffer Gate With 3-State Outputs; HEIGHT: 1.1
IC3 = qualified_1:SN74LVC1G126: Single Bus Buffer Gate With 3-State Outputs; DM: 0; DR: 90.000; DX: 58.050; DY: 17.100; HEIGHT: 1.1; SHEETNO: 4
IC4 = qualified_1:FT232R: Source: http://www.ftdichip.com/Documents/DataSheets/DS_FT232R_v104.pdf; DM: 0; DR: 0.000; DX: 61.700; DY: 13.850; HEIGHT: 0.9; MPN: FT232RQ; OC_FARNELL: 1146033; OC_NEWARK: 91K9919; SHEETNO: 4
IC5 = qualified_1:TPS62111; DM: 0; DR: 180.000; DX: 74.800; DY: 22.000; HEIGHT: 1; SHEETNO: 1
IC6 = qualified_1:TPS2051; HEIGHT: 1.1
J1 = qualified_1:JST-GH-4
J2 J8 J11 = qualified_1:FPC-15: FPC 15 Connector 15 pin 1mm pitch FPC connector
J7 = qualified_1:USB-TYPE-C
J9 = qualified_1:HDMI
J10 = qualified_1:USB-A-H-RA: USB Connectors
J12 = qualified_1:JST-GH-6
L1-L4 L9 L11 = qualified_1:COM_MODE_CHOKE; HEIGHT: 0.83
L10 = qualified_1:L; HEIGHT: 1.9
M1 = qualified_1:SPH0645LM4H-B: Mic Mems Digital I2s Omni -26db; DESCRIPTION: Mic Mems Digital I2s Omni -26db; DIGI-KEY_PART_NUMBER: 423-1405-1-ND; DIGI-KEY_PURCHASE_URL: https://www.digikey.com/product-detail/en/knowles/SPH0645LM4H-B/423-1405-1-ND/5332432?utm_source=snapeda&utm_medium=aggregator&utm_campaign=symbol; MF: Knowles; MP: SPH0645LM4H-B; PACKAGE: SIP-7 Bourns
Q1 Q2 = qualified_1:BSS138: N-Channel Enhancement MOSFET; HEIGHT: 1.12
R1-R4 R6-R12 R14 R16-R22 R24-R26 R28-R31 = qualified_1:R; HEIGHT: 0.25
R5 R23 R27 = qualified_1:R; HEIGHT: 0.35
R13 R15 = qualified_1:R; DM: 0; DR: 270.000; DX: 72.800; DY: 18.400; HEIGHT: 0.35; SHEETNO: 1
S1 S3 = qualified_1:EVQ; HEIGHT: 2
U1 U8 = qualified_1:SK6812: RGB LED
U4 = qualified_1:TLV751
U6 = qualified_1:TPD4E02B04: TPD4E02B04 4-Channel ESD Protection Diode for USB Type-C and HDMI 2.0 http://www.ti.com/lit/ds/symlink/tpd4e02b04.pdf
U7 = qualified_1:TXS0104E: 4-bit Bidirectional Level Translator http://www.ti.com/lit/ds/symlink/txs0104e.pdf
U16 U18 = qualified_1:TS3A5223: TS3A5223 0.45Ω Dual SPDT Bidirectional Analog Switch Package: UQFN-10 Source: http://www.ti.com/lit/ds/symlink/ts3a5223.pdf
U$3 = qualified_1:TPD13S523: TPD13S523 13-Channel ESD Protection Solution With Current-Limit Load Switch For HDMI Transmitter Ports http://www.ti.com/lit/ds/symlink/tpd13s523.pdf
U$4 = qualified_1:GEPPETTO_LABEL; BOARD: PCB900000001506v2; TITLE: Gumstix Raspberry Pi CM Robo; YEAR: 2020
U$5 = qualified_1:GEPPETTO_LOGO
X1 = qualified_1:DM-200P-SODIMM: DM-200P CONNECTOR Socket for DDR/DDR2 SODIMM 200 pin Source: http://www.jst-mfg.com/product/pdf/eng/eDM-200P.pdf

## Net classes
1 supply: width 0.254 mm
2 analog: width 0.178 mm
4 xxwide: width 0.203 mm
5 USB: width 0.2 mm, clearance 0.2 mm
6 HDMI: width 0.2 mm, clearance 0.3 mm
7 50_OHM: width 0.378 mm, clearance 0.3 mm